# EAGLE schematic pds019_main_082_ext (EAGLE 9.6.2)

## Sheet 1 of 4
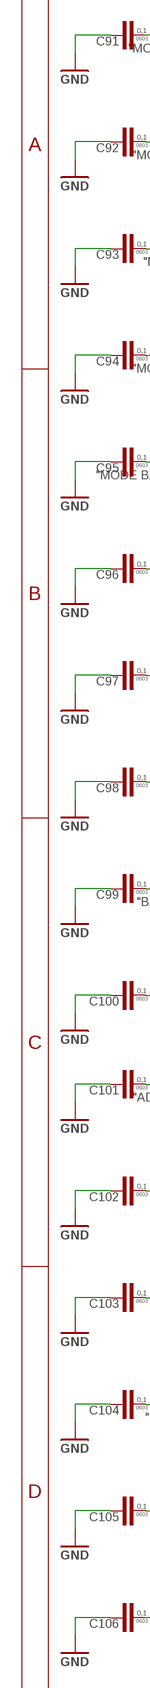
[diagram p0: schematic, sheet 1, part 1 of 2]
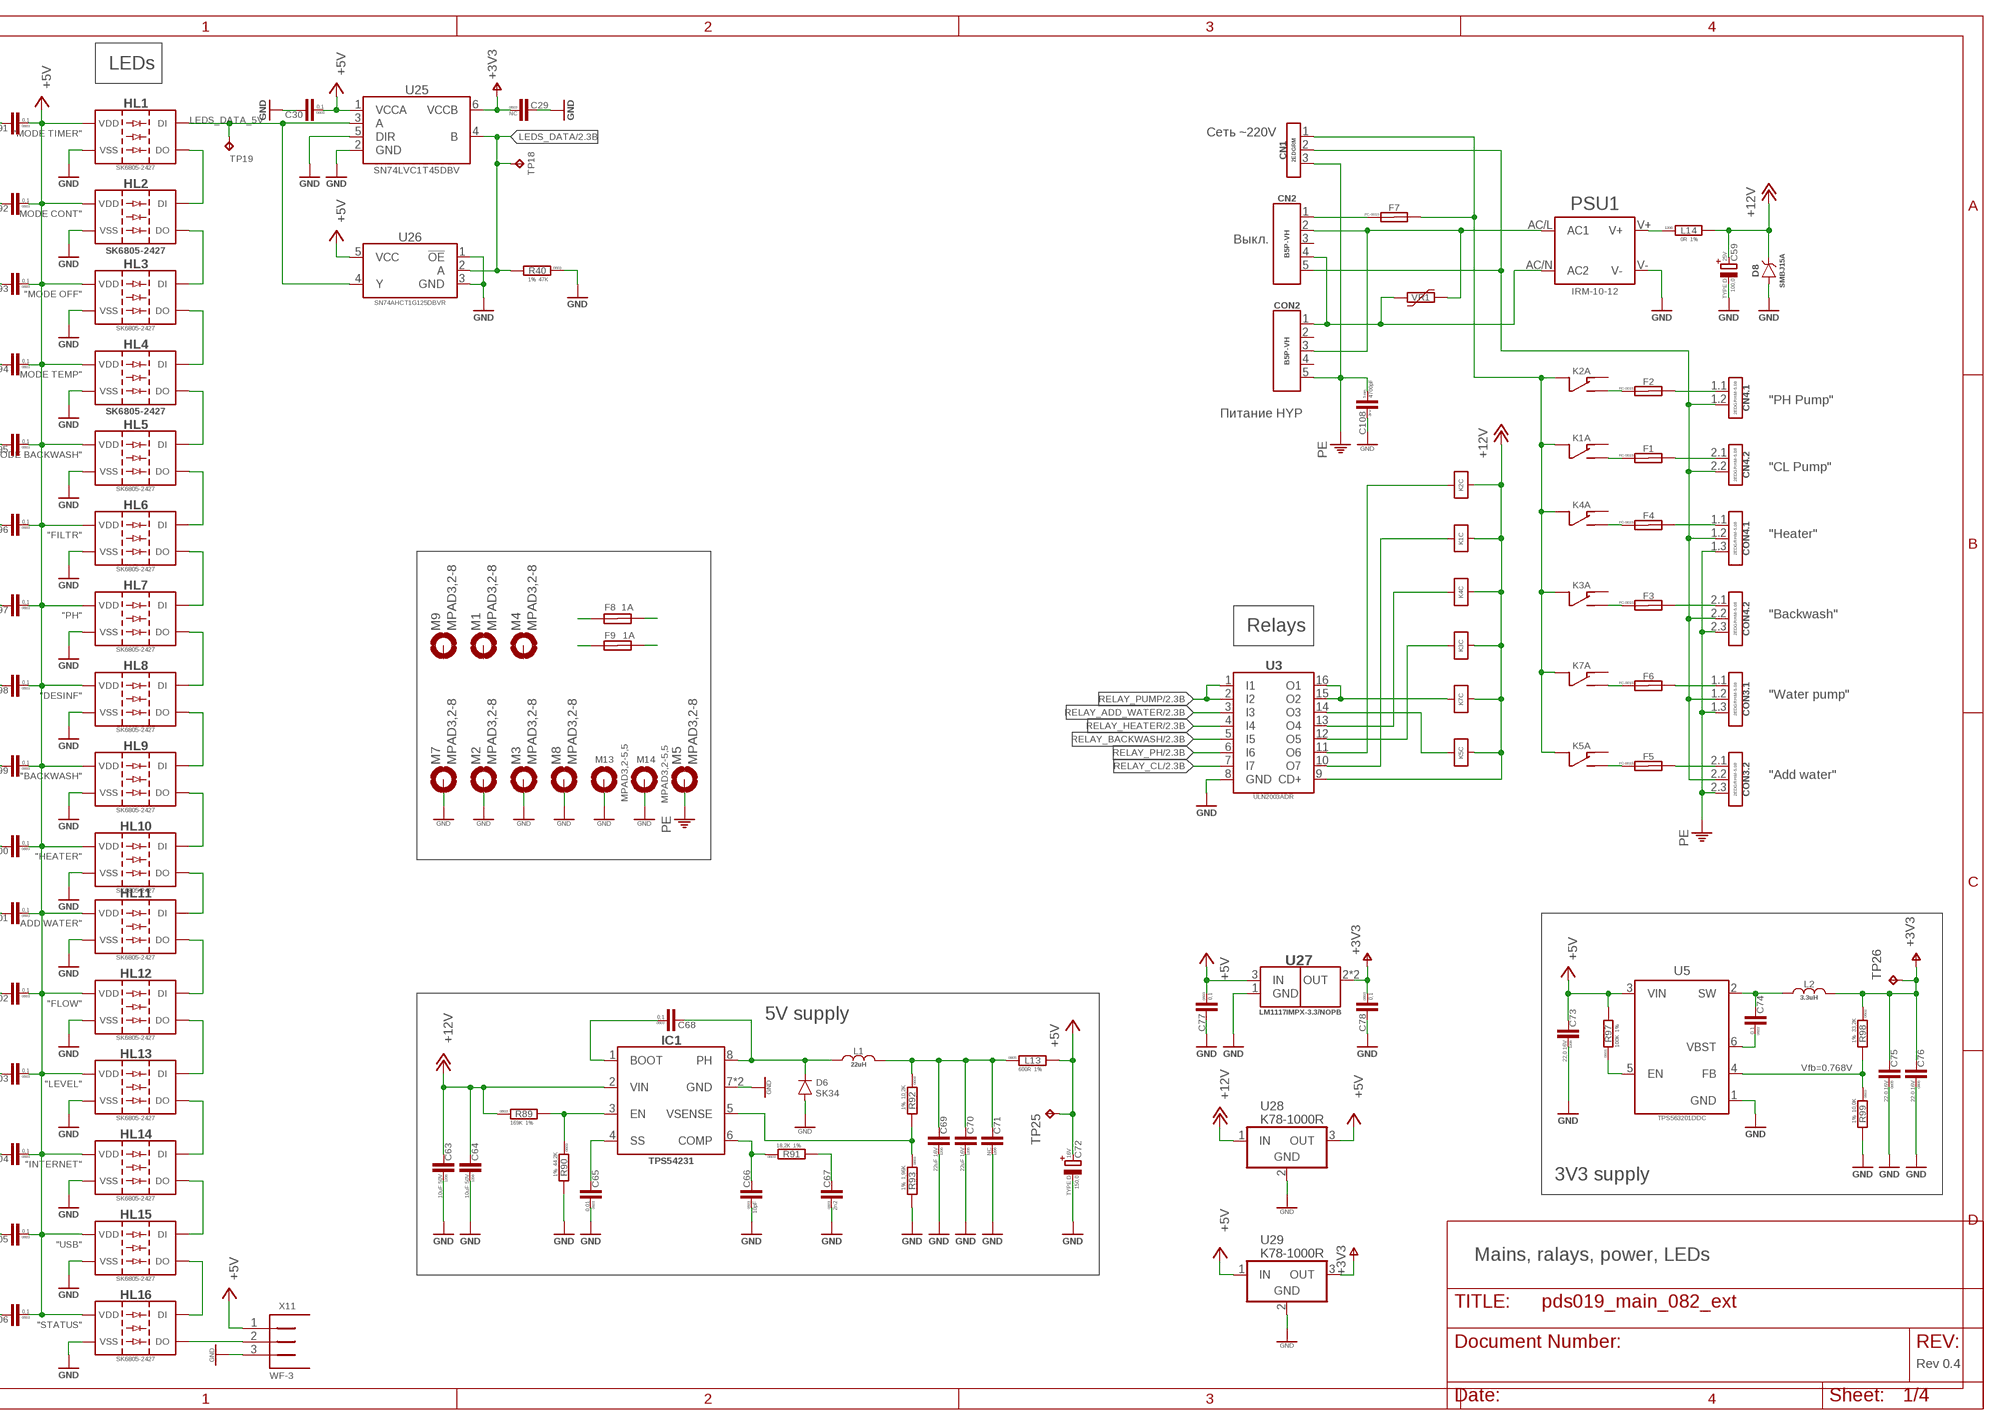
[diagram p1: schematic, sheet 1, part 2 of 2]

### Parts
C29  NC  C-0603  [C0603]
C30  0,1  C-0603  [C0603]
C59  100,0  CPOL-SMD-TYPE-D  [CTANT_7X4]
C63  10uF 50V  C-1206  [C1206]
C64  10uF 50V  C-1206  [C1206]
C65  0,01  C-0603  [C0603]
C66  10pF  C-0603  [C0603]
C67  2n2  C-0603  [C0603]
C68  0,1  C-0603  [C0603]
C69  22uF 16V  C-1206  [C1206]
C70  22uF 16V  C-1206  [C1206]
C71  NC  C-1206  [C1206]
C72  150,0  CPOL-SMD-TYPE-D  [CTANT_7X4]
C73  22,0 16V  C-1206  [C1206]
C74  0,1  C-0603  [C0603]
C75  22,0 16V  C-0805  [C0805]
C76  22,0 16V  C-0805  [C0805]
C77  0,1  C-0603  [C0603]
C78  0,1  C-0603  [C0603]
C91  0,1  C-0603  [C0603]
C92  0,1  C-0603  [C0603]
C93  0,1  C-0603  [C0603]
C94  0,1  C-0603  [C0603]
C95  0,1  C-0603  [C0603]
C96  0,1  C-0603  [C0603]
C97  0,1  C-0603  [C0603]
C98  0,1  C-0603  [C0603]
C99  0,1  C-0603  [C0603]
C100  0,1  C-0603  [C0603]
C101  0,1  C-0603  [C0603]
C102  0,1  C-0603  [C0603]
C103  0,1  C-0603  [C0603]
C104  0,1  C-0603  [C0603]
C105  0,1  C-0603  [C0603]
C106  0,1  C-0603  [C0603]
C108  4700pF  C-RADIAL-5MM  [C_5MM]
CN1  2EDGRM-7.62-03P  CON-3P-2EDGRM-7.62  [2EDGRM-7.62-03P]
CN2  CON-5P-JST-VH  [B5P-VH]
CN4  CON-2X2  [2EDGRHM-5.08-04P]
CON2  CON-5P-JST-VH  [B5P-VH]
CON3  CON-2X3  [2EDGRHM-5.08-06P]
CON4  CON-2X3  [2EDGRHM-5.08-06P]
D6  SK34  SS34  [DO-214AC(SMA)]
D8  SMBJ15A  SMBJ15A-SMB  [DO-214AA(SMB)]
F1  1A  FUSE-FC-001S  [FC-001S]
F2  1A  FUSE-FC-001S  [FC-001S]
F3  1A  FUSE-FC-001S  [FC-001S]
F4  1A  FUSE-FC-001S  [FC-001S]
F5  1A  FUSE-FC-001S  [FC-001S]
F6  1A  FUSE-FC-001S  [FC-001S]
F7  1A  FUSE-FC-001S  [FC-001S]
F8  1A  FUSE-FC-001S  [FC-001S]
F9  1A  FUSE-FC-001S  [FC-001S]
HL1  SK6805-2427  NEOPIXEL-SK6805-2427  [SK6805-2427]
HL2  SK6805-2427  NEOPIXEL-SK6805-2427  [SK6805-2427]
HL3  SK6805-2427  NEOPIXEL-SK6805-2427  [SK6805-2427]
HL4  SK6805-2427  NEOPIXEL-SK6805-2427  [SK6805-2427]
HL5  SK6805-2427  NEOPIXEL-SK6805-2427  [SK6805-2427]
HL6  SK6805-2427  NEOPIXEL-SK6805-2427  [SK6805-2427]
HL7  SK6805-2427  NEOPIXEL-SK6805-2427  [SK6805-2427]
HL8  SK6805-2427  NEOPIXEL-SK6805-2427  [SK6805-2427]
HL9  SK6805-2427  NEOPIXEL-SK6805-2427  [SK6805-2427]
HL10  SK6805-2427  NEOPIXEL-SK6805-2427  [SK6805-2427]
HL11  SK6805-2427  NEOPIXEL-SK6805-2427  [SK6805-2427]
HL12  SK6805-2427  NEOPIXEL-SK6805-2427  [SK6805-2427]
HL13  SK6805-2427  NEOPIXEL-SK6805-2427  [SK6805-2427]
HL14  SK6805-2427  NEOPIXEL-SK6805-2427  [SK6805-2427]
HL15  SK6805-2427  NEOPIXEL-SK6805-2427  [SK6805-2427]
HL16  SK6805-2427  NEOPIXEL-SK6805-2427  [SK6805-2427]
IC1  TPS54231  [SOIC8-POWERPAD]
K1  HLS8-22F-DC12V-C  SRD-U  [SRD_UNIV]
K2  HLS8-22F-DC12V-C  SRD-U  [SRD_UNIV]
K3  HLS8-22F-DC12V-C  SRD-U  [SRD_UNIV]
K4  HLS8-22F-DC12V-C  SRD-U  [SRD_UNIV]
K5  HLS8-22F-DC12V-C  SRD-U  [SRD_UNIV]
K7  SRD-SLC  [SLC-12VDC-SL-C]
L1  22uH  22µH-0630  [LSMD_06030]
L2  3.3uH  3.3µH-0520  [LSMD_05020]
L13  600R  R-1%-0805  [R0805]
L14  0R  R-1%-1206  [R1206]
M1  MPAD3,2-8  [MPAD_3,2_8]
M2  MPAD3,2-8  [MPAD_3,2_8]
M3  MPAD3,2-8  [MPAD_3,2_8]
M4  MPAD3,2-8  [MPAD_3,2_8]
M5  MPAD3,2-8  [MPAD_3,2_8]
M7  MPAD3,2-8  [MPAD_3,2_8]
M8  MPAD3,2-8  [MPAD_3,2_8]
M9  MPAD3,2-8  [MPAD_3,2_8]
M13  MPAD3,2-5,5  [MPAD_3,2_5,5]
M14  MPAD3,2-5,5  [MPAD_3,2_5,5]
PSU1  IRM-10-12  [IRM-10]
R40  47K  R-1%-0603  [R0603]
R89  169K  R-1%-0603  [R0603]
R90  44,2K  R-1%-0603  [R0603]
R91  18,2K  R-1%-0603  [R0603]
R92  10,2K  R-1%-0603  [R0603]
R93  1,96K  R-1%-0603  [R0603]
R97  100K  R-1%-0603  [R0603]
R98  33,2K  R-1%-0603  [R0603]
R99  10,0K  R-1%-0603  [R0603]
TP18  TPTP16R  [TP16R]
TP19  TPTP16R  [TP16R]
TP25  TPTP16R  [TP16R]
TP26  TPTP16R  [TP16R]
U3  ULN2003AD  [SO16]
U5  TPS563201DDC  TPS563200  [SOT23-6]
U25  NC  SN74LVC1T45DBV  [SOT23-6]
U26  SN74AHCT1G125DBVR-SOT23-5  [SOT23-5]
U27  3.3V  LM1117-3.3-SOT223  [SOT-223]
U28  K78-1000R  [K78XX-1000R3_V]
U29  K78-1000R  [K78XX-1000R3_V]
VR1  S20K275  VARISTOR-22MM  [S20K420]
X11  WF-3  CONN_3PIN-KF2510-03  [KF2510-03]

### Nets
3V3_EN: R97.1 U5.5(EN)
+3V3: C29.1 C75.2 C76.2 C78.1 L2.2 R98.1 TP26.TP U25.6(VCCB) U27.2(OUT) U27.4(OUT) U29.3(OUT) ; also sheet 2,3
+5V: C30.1 C72.+ C73.P$2 C77.1 C91.1 C92.1 C93.1 C94.1 C95.1 C96.1 C97.1 C98.1 C99.1 C100.1 C101.1 C102.1 C103.1 C104.1 C105.1 C106.1 HL1.4(VDD) HL2.4(VDD) HL3.4(VDD) HL4.4(VDD) HL5.4(VDD) HL6.4(VDD) HL7.4(VDD) HL8.4(VDD) HL9.4(VDD) HL10.4(VDD) HL11.4(VDD) HL12.4(VDD) HL13.4(VDD) HL14.4(VDD) HL15.4(VDD) HL16.4(VDD) L13.2 R97.2 TP25.TP U5.3(VIN) U25.1(VCCA) U26.5(VCC) U27.3(IN) U28.3(OUT) U29.1(IN) X11.1 ; also sheet 2,3
+12V: C59.+ C63.P$2 C64.P$2 D8.C IC1.2(VIN) K1.2 K2.2 K3.2 K4.2 K5.2 K7.C2 L14.P$2 R89.1 U3.9(CD+) U28.1(IN) ; also sheet 3
AC_L: CN1.1 F7.2-1 F7.2-2 K1.1(A:COM) K2.1(A:COM) K3.1(A:COM) K4.1(A:COM) K5.1(A:COM) K7.COM(A:COM)
AC_N: CN1.2 CN2.5 CN4.1.2 CN4.2.2 CON3.1.2 CON3.2.2 CON4.1.2 CON4.2.2
F8-1: F8.1-1 F8.1-2
F8-2: F8.2-1 F8.2-2
F9-1: F9.1-1 F9.1-2
F9-2: F9.2-1 F9.2-2
GND: C29.2 C30.2 C59.- C63.P$1 C64.P$1 C65.1 C66.1 C67.1 C69.P$1 C70.P$1 C71.P$1 C72.- C73.P$1 C75.1 C76.1 C77.2 C78.2 C91.2 C92.2 C93.2 C94.2 C95.2 C96.2 C97.2 C98.2 C99.2 C100.2 C101.2 C102.2 C103.2 C104.2 C105.2 C106.2 C108.2 D6.A D8.A HL1.2(VSS) HL2.2(VSS) HL3.2(VSS) HL4.2(VSS) HL5.2(VSS) HL6.2(VSS) HL7.2(VSS) HL8.2(VSS) HL9.2(VSS) HL10.2(VSS) HL11.2(VSS) HL12.2(VSS) HL13.2(VSS) HL14.2(VSS) HL15.2(VSS) HL16.2(VSS) IC1.7(GND) IC1.POWERPAD(GND) M2.1(MOUNT) M3.1(MOUNT) M7.1(MOUNT) M8.1(MOUNT) M13.1(MOUNT) M14.1(MOUNT) PSU1.V- R40.1 R90.2 R93.2 R99.2 U3.8(GND) U5.1(GND) U25.2(GND) U25.5(DIR) U26.1(!OE) U26.3(GND) U27.1(GND) U28.2(GND) U29.2(GND) X11.3 ; also sheet 2,3
LED1_LED2: HL1.1(DO) HL2.3(DI)
LED2_LED3: HL2.1(DO) HL3.3(DI)
LED3_LED4: HL3.1(DO) HL4.3(DI)
LED4_LED5: HL4.1(DO) HL5.3(DI)
LED6_LED7: HL5.1(DO) HL6.3(DI)
LED7_LED8: HL7.1(DO) HL8.3(DI)
LED8_LED9: HL8.1(DO) HL9.3(DI)
LED9_LED10: HL9.1(DO) HL10.3(DI)
LED10_LED11: HL10.1(DO) HL11.3(DI)
LED11_LED12: HL11.1(DO) HL12.3(DI)
LED12_LED13: HL12.1(DO) HL13.3(DI)
LED13_LED14: HL13.1(DO) HL14.3(DI)
LED14_LED15: HL14.1(DO) HL15.3(DI)
LED15_LED16: HL15.1(DO) HL16.3(DI)
LEDS_DATA: R40.2 TP18.TP U25.4(B) U26.2(A) ; also sheet 2
LEDS_DATA_5V: HL1.3(DI) TP19.TP U25.3(A) U26.4(Y) ; also sheet 2
N$6: CN2.1 F7.1-1 F7.1-2
N$7: CN2.2 CON2.3 PSU1.AC/L(AC1) VR1.2
N$8: CN2.4 CON2.1 PSU1.AC/N(AC2) VR1.1
N$16: L14.P$1 PSU1.V+
N$17: C69.P$2 C70.P$2 C71.P$2 L1.2 L13.1 R92.1
N$39: K7.C1 U3.15(O2) U3.16(O1)
N$45: HL6.1(DO) HL7.3(DI)
N$54: HL16.1(DO) X11.2
N$60: F2.1-1 F2.1-2 K2.3(A:NO)
N$69: C65.2 IC1.4(SS)
N$112: K2.5 U3.11(O6)
N$116: K1.5 U3.10(O7)
N$149: C68.1 IC1.1(BOOT)
N$164: K4.5 U3.13(O4)
N$170: K3.5 U3.12(O5)
N$175: K5.5 U3.14(O3)
N$183: F6.1-1 F6.1-2 K7.NO(A:NO)
N$190: C68.2 D6.C IC1.8(PH) L1.1
N$192: C66.2 IC1.6(COMP) R91.1
N$198: C67.2 R91.2
N$201: CN4.1.1 F2.2-1 F2.2-2
N$202: CN4.2.1 F1.2-1 F1.2-2
N$203: F1.1-1 F1.1-2 K1.3(A:NO)
N$204: CON4.1.1 F4.2-1 F4.2-2
N$205: IC1.5(VSENSE) R92.2 R93.1
N$207: IC1.3(EN) R89.2 R90.1
N$208: F4.1-1 F4.1-2 K4.3(A:NO)
N$211: CON4.2.1 F3.2-1 F3.2-2
N$212: F3.1-1 F3.1-2 K3.3(A:NO)
N$214: CON3.1.1 F6.2-1 F6.2-2
N$215: F5.1-1 F5.1-2 K5.3(A:NO)
N$217: CON3.2.1 F5.2-1 F5.2-2
PE: C108.1 CN1.3 CON2.5 CON3.1.3 CON3.2.3 CON4.1.3 CON4.2.3 M5.1(MOUNT) ; also sheet 3
RELAY_ADD_WATER: U3.3(I3) ; also sheet 2
RELAY_BACKWASH: U3.5(I5) ; also sheet 2
RELAY_CL: U3.7(I7) ; also sheet 2
RELAY_HEATER: U3.4(I4) ; also sheet 2
RELAY_PH: U3.6(I6) ; also sheet 2
RELAY_PUMP: U3.1(I1) U3.2(I2) ; also sheet 2
TPS56_FB: R98.2 R99.1 U5.4(FB)
TPS56_SW: C74.2 L2.1 U5.2(SW)
TPS56_VBST: C74.1 U5.6(VBST)
Unconnected: CN2.3 CON2.2 CON2.4 K1.4(A:NC) K2.4(A:NC) K3.4(A:NC) K4.4(A:NC) K5.4(A:NC) K7.NC(A:NC) M1.1(MOUNT) M4.1(MOUNT) M9.1(MOUNT)

### Notes on the sheet
- LEDs
- "MODE TIMER" | Сеть ~220V
- "MODE CONT"
- Выкл.
- "MODE OFF"
- "MODE TEMP"
- "PH Pump"
- Питание HYP
- "MODE BACKWASH"
- "CL Pump"
- "FILTR" | "Heater"
- "PH" | "Backwash"
- Relays
- "DESINF" | "Water pump"
- "BACKWASH" | "Add water"
- "HEATER"
- "ADD WATER"
- "FLOW"
- 5V supply
- Vfb=0.768V
- "LEVEL"
- "INTERNET"
- 3V3 supply
- "USB"
- Mains, ralays, power, LEDs
- "STATUS"
- Rev 0.4

## Sheet 2 of 4
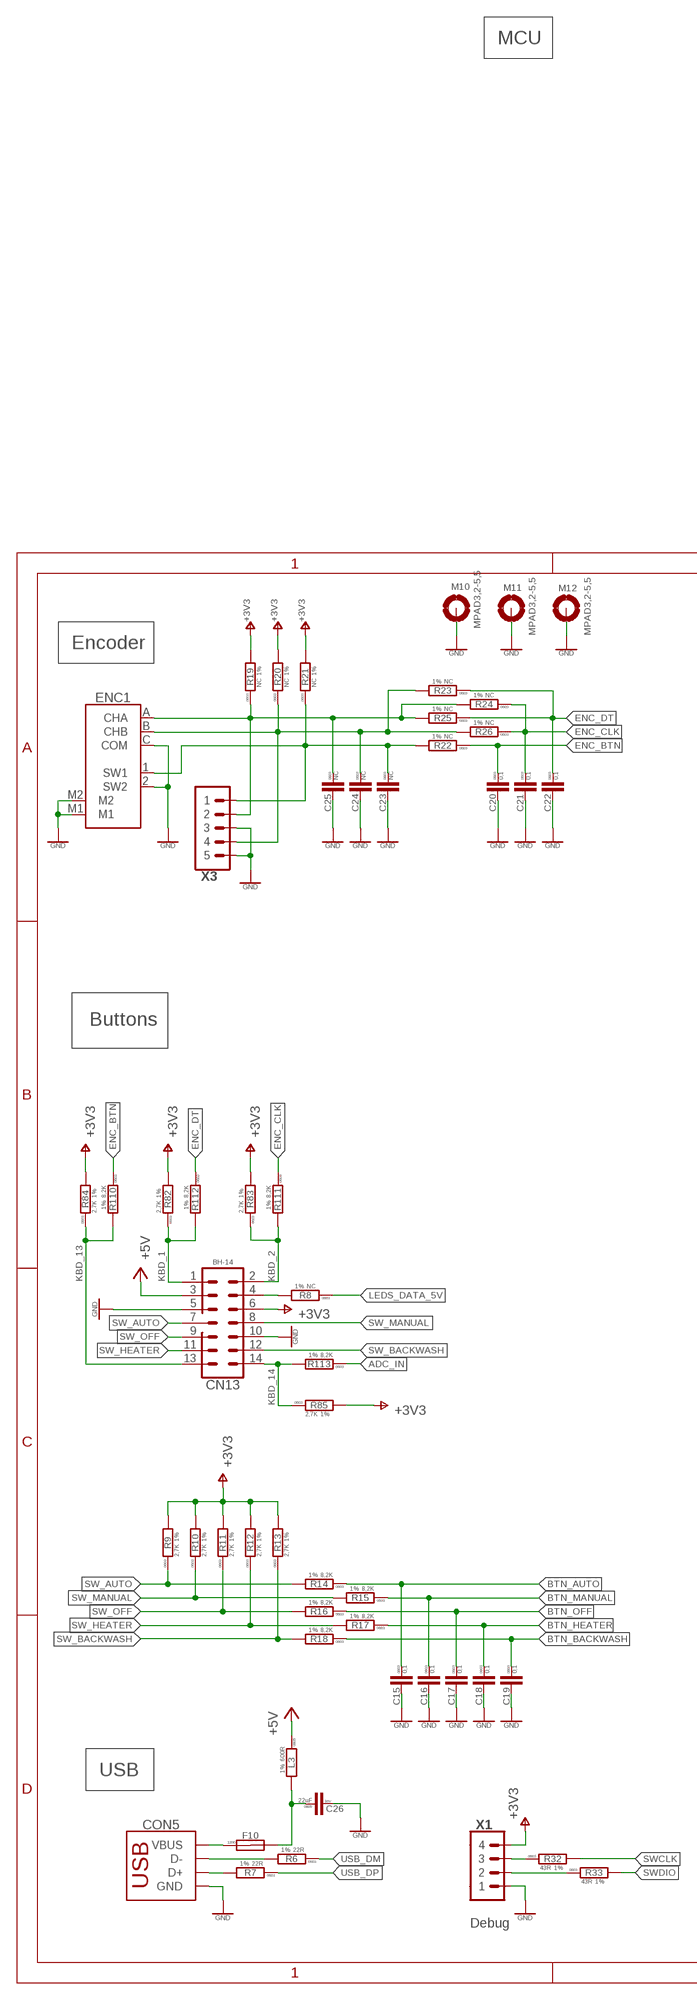
[diagram p2: schematic, sheet 2, part 1 of 2]
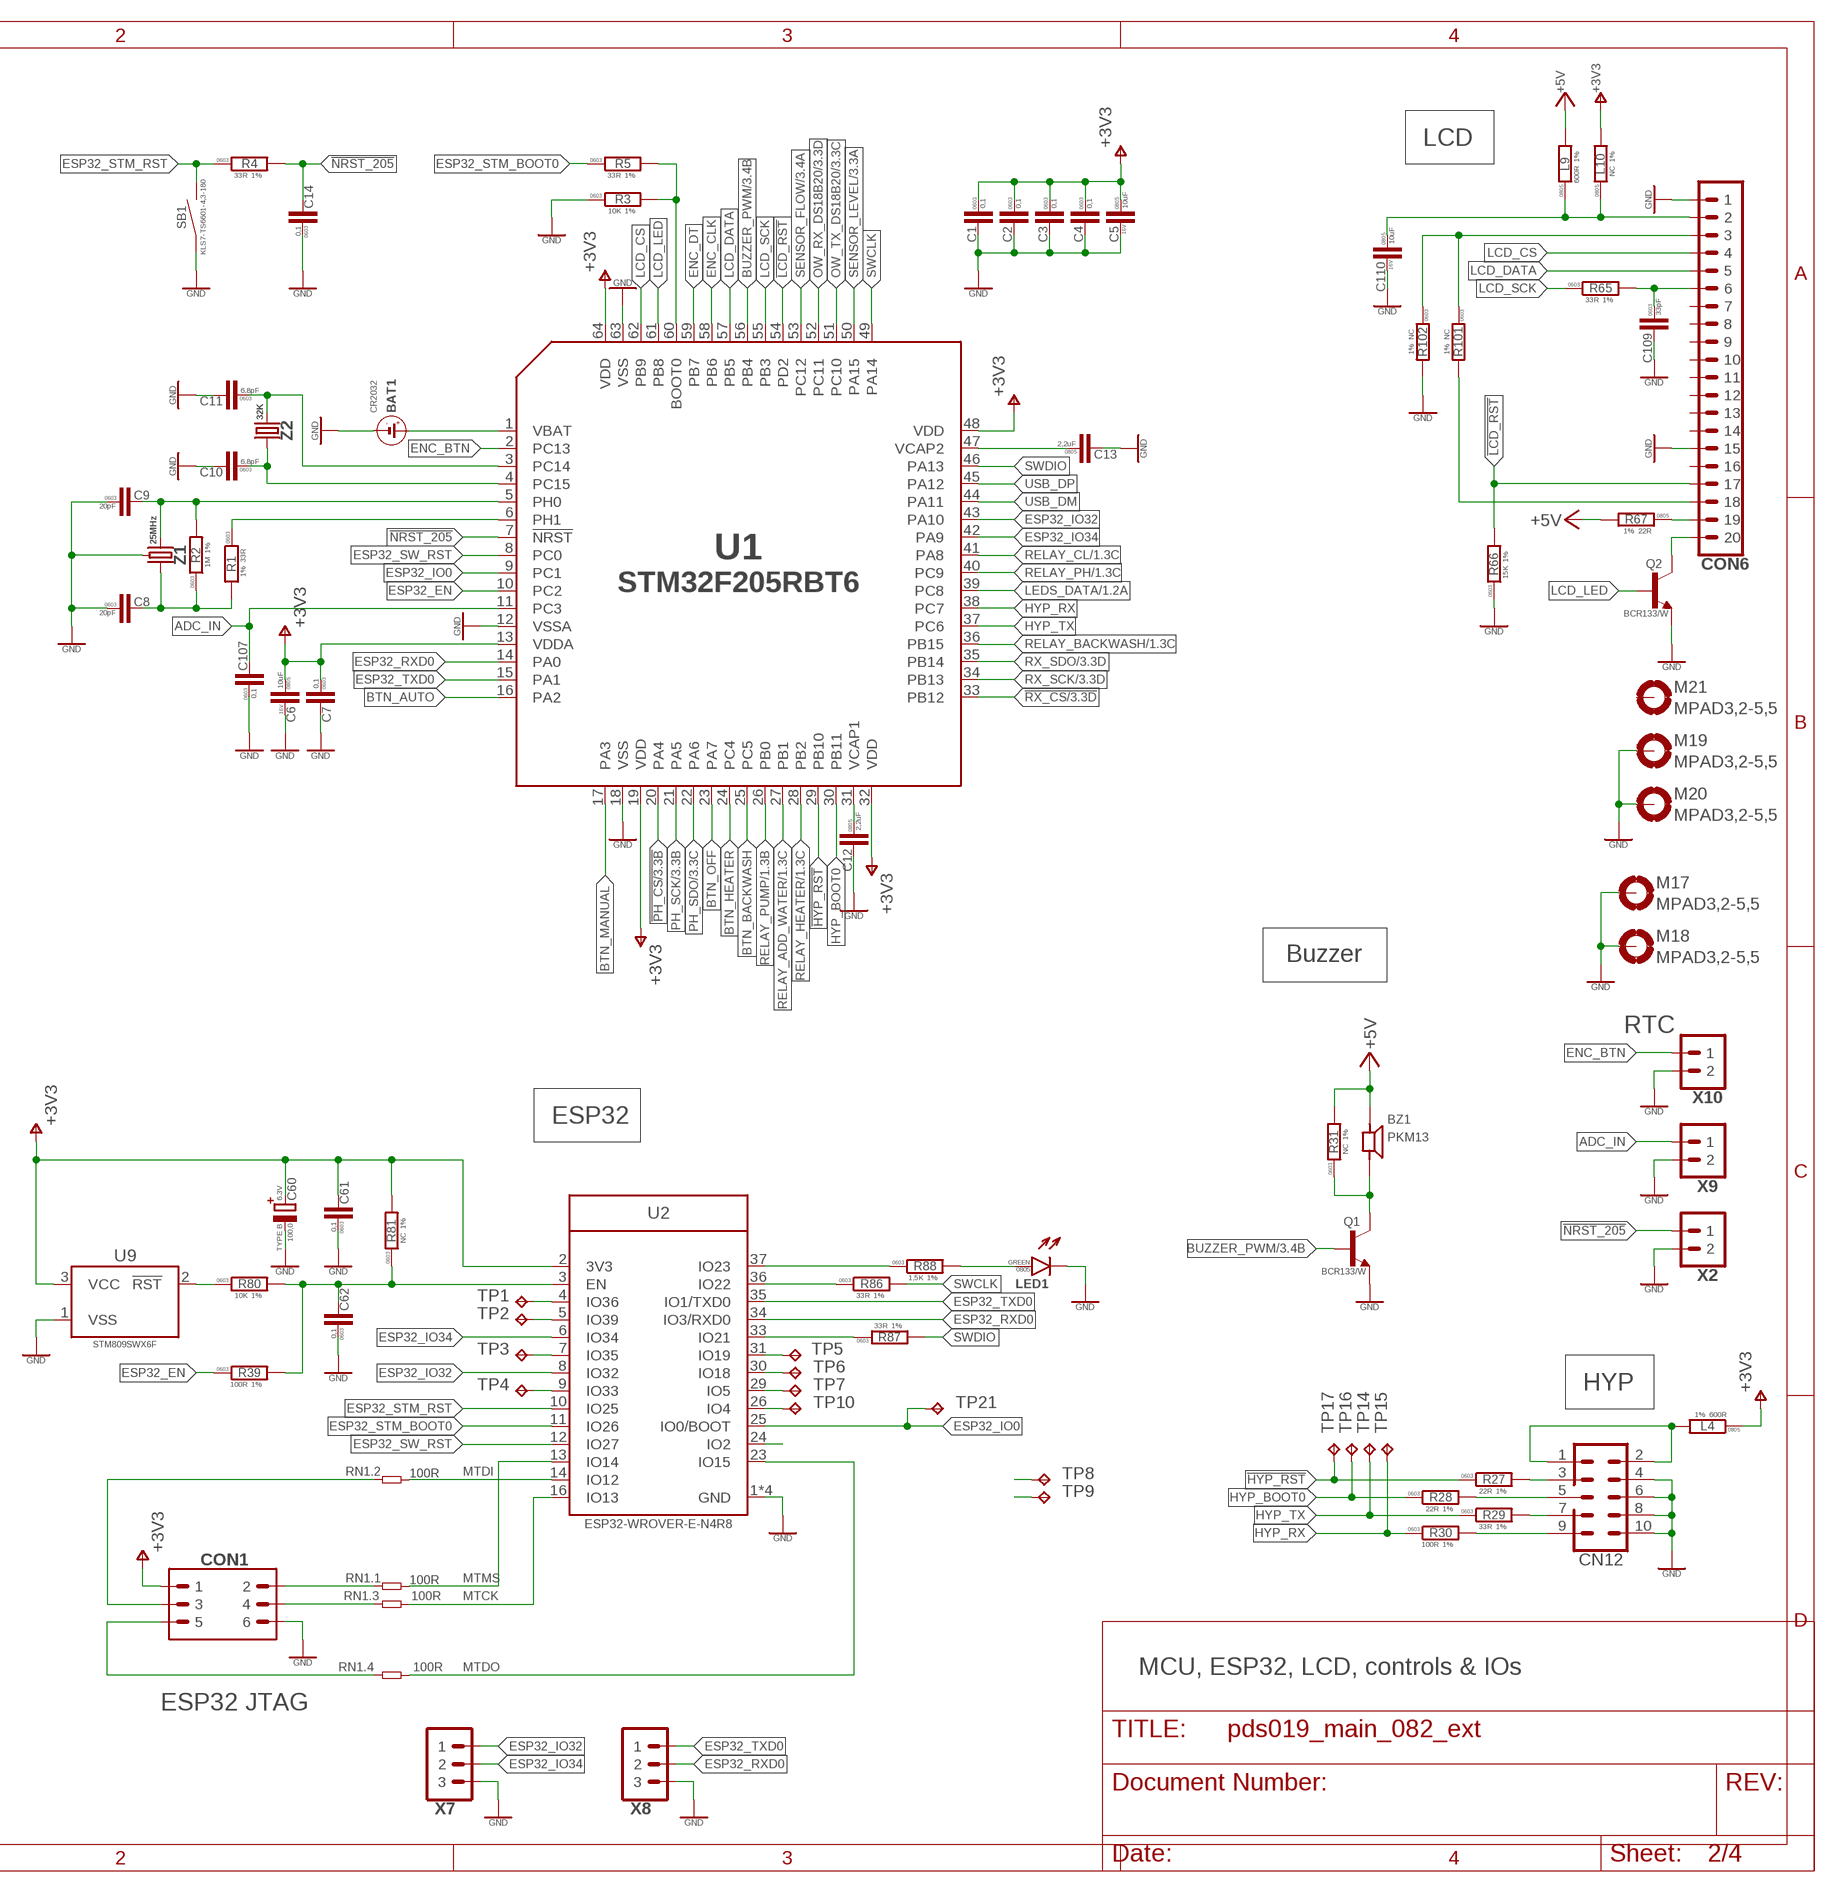
[diagram p3: schematic, sheet 2, part 2 of 2]

### Parts
BAT1  BATTERY-L-KLS5-CR2032-01  [CR2032H]
BZ1  PKM13  BUZZER-PKM13  [PKM13]
C1  0,1  C-0603  [C0603]
C2  0,1  C-0603  [C0603]
C3  0,1  C-0603  [C0603]
C4  0,1  C-0603  [C0603]
C5  10uF  C-0805  [C0805]
C6  10uF  C-0805  [C0805]
C7  0,1  C-0603  [C0603]
C8  20pF  C-0603  [C0603]
C9  20pF  C-0603  [C0603]
C10  6,8pF  C-0603  [C0603]
C11  6,8pF  C-0603  [C0603]
C12  2,2uF  C-0805  [C0805]
C13  2,2uF  C-0805  [C0805]
C14  0,1  C-0603  [C0603]
C15  0,1  C-0603  [C0603]
C16  0,1  C-0603  [C0603]
C17  0,1  C-0603  [C0603]
C18  0,1  C-0603  [C0603]
C19  0,1  C-0603  [C0603]
C20  0,1  C-0603  [C0603]
C21  0,1  C-0603  [C0603]
C22  0,1  C-0603  [C0603]
C23  NC  C-0603  [C0603]
C24  NC  C-0603  [C0603]
C25  NC  C-0603  [C0603]
C26  22uF  C-0805  [C0805]
C60  100,0  CPOL-TANT-TYPE-B  [CTANT_B]
C61  0,1  C-0603  [C0603]
C62  0,1  C-0603  [C0603]
C107  0,1  C-0603  [C0603]
C109  33pF  C-0603  [C0603]
C110  10uF  C-0805  [C0805]
CN12  BH-10  IDC_CONN10-BH10  [IDC_2X05]
CN13  BH14  IDC_CONN14-BH14  [IDC_2X07]
CON1  PINHEAD_2X03-PTH-2.54  [2X03-PTH-2.54]
CON5  USB-A-KLS1-191  [KLS1-191-4P-0.7]
CON6  PINHEAD_1X20-2.54-MALE-LONG  [1X20-PTH-2.54-LONG]
ENC1  PEC12R-4XXXF-S  ENC-PEC12R-4XXXF-SXXXX  [PEC12R-4XXXF-SXXXX]
F10  FUSE-1206  [F1206]
L3  600R  R-1%-0805  [R0805]
L4  600R  R-1%-0805  [R0805]
L9  600R  R-1%-0805  [R0805]
L10  NC  R-1%-0805  [R0805]
LED1  LED-0805  [LED0805]
M10  MPAD3,2-5,5  [MPAD_3,2_5,5]
M11  MPAD3,2-5,5  [MPAD_3,2_5,5]
M12  MPAD3,2-5,5  [MPAD_3,2_5,5]
M17  MPAD3,2-5,5  [MPAD_3,2_5,5]
M18  MPAD3,2-5,5  [MPAD_3,2_5,5]
M19  MPAD3,2-5,5  [MPAD_3,2_5,5]
M20  MPAD3,2-5,5  [MPAD_3,2_5,5]
M21  MPAD3,2-5,5  [MPAD_3,2_5,5]
Q1  NC  BCR133  [SOT23B-3]
Q2  BCR133  [SOT23B-3]
R1  33R  R-1%-0603  [R0603]
R2  1M  R-1%-0603  [R0603]
R3  10K  R-1%-0603  [R0603]
R4  33R  R-1%-0603  [R0603]
R5  33R  R-1%-0603  [R0603]
R6  22R  R-1%-0603  [R0603]
R7  22R  R-1%-0603  [R0603]
R8  NC  R-1%-0603  [R0603]
R9  2,7K  R-1%-0603  [R0603]
R10  2,7K  R-1%-0603  [R0603]
R11  2,7K  R-1%-0603  [R0603]
R12  2,7K  R-1%-0603  [R0603]
R13  2,7K  R-1%-0603  [R0603]
R14  8,2K  R-1%-0603  [R0603]
R15  8,2K  R-1%-0603  [R0603]
R16  8,2K  R-1%-0603  [R0603]
R17  8,2K  R-1%-0603  [R0603]
R18  8,2K  R-1%-0603  [R0603]
R19  NC  R-1%-0603  [R0603]
R20  NC  R-1%-0603  [R0603]
R21  NC  R-1%-0603  [R0603]
R22  NC  R-1%-0603  [R0603]
R23  NC  R-1%-0603  [R0603]
R24  NC  R-1%-0603  [R0603]
R25  NC  R-1%-0603  [R0603]
R26  NC  R-1%-0603  [R0603]
R27  22R  R-1%-0603  [R0603]
R28  22R  R-1%-0603  [R0603]
R29  33R  R-1%-0603  [R0603]
R30  100R  R-1%-0603  [R0603]
R31  NC  R-1%-0603  [R0603]
R32  43R  R-1%-0603  [R0603]
R33  43R  R-1%-0603  [R0603]
R39  100R  R-1%-0603  [R0603]
R65  33R  R-1%-0603  [R0603]
R66  15K  R-1%-0603  [R0603]
R67  22R  R-1%-0805  [R0805]
R80  10K  R-1%-0603  [R0603]
R81  NC  R-1%-0603  [R0603]
R82  2,7K  R-1%-0603  [R0603]
R83  2,7K  R-1%-0603  [R0603]
R84  2,7K  R-1%-0603  [R0603]
R85  2,7K  R-1%-0603  [R0603]
R86  33R  R-1%-0603  [R0603]
R87  33R  R-1%-0603  [R0603]
R88  1,5K  R-1%-0603  [R0603]
R101  NC  R-1%-0603  [R0603]
R102  NC  R-1%-0603  [R0603]
R110  8,2K  R-1%-0603  [R0603]
R111  8,2K  R-1%-0603  [R0603]
R112  8,2K  R-1%-0603  [R0603]
R113  8,2K  R-1%-0603  [R0603]
RN1  100R  RN4X1_EXP-YC164  [RN_YC164]
SB1  KLS7-TS6601-4,3-180  TACT_SWITCH-6X6-PTH  [SW4-6.0X6.0X5.0MM]
TP1  TPTP18R  [TP18R]
TP2  TPTP18R  [TP18R]
TP3  TPTP18R  [TP18R]
TP4  TPTP18R  [TP18R]
TP5  TPTP16R  [TP16R]
TP6  TPTP16R  [TP16R]
TP7  TPTP16R  [TP16R]
TP8  TPTP16R  [TP16R]
TP9  TPTP16R  [TP16R]
TP10  TPTP16R  [TP16R]
TP14  TPTP16R  [TP16R]
TP15  TPTP16R  [TP16R]
TP16  TPTP16R  [TP16R]
TP17  TPTP16R  [TP16R]
TP21  TPTP16R  [TP16R]
U1  STM32F2xxR  STM32F205RBT6  [TQFP64]
U2  ESP32-WROVER-(I)E  [ESP32-WROVER-E]
U9  MAX809S  [SOT23B-3]
X1  PINHEAD_1X04-2.54  [1X04-PTH-2.54]
X2  PINHEAD_1X02-2.54  [1X02-PTH-2.54]
X3  PINHEAD_1X05-2.54  [1X05-PTH-2.54]
X7  PINHEAD_1X03-2.54  [1X03-PTH-2.54]
X8  PINHEAD_1X03-2.54  [1X03-PTH-2.54]
X9  PINHEAD_1X02-2.54  [1X02-PTH-2.54]
X10  PINHEAD_1X02-2.54  [1X02-PTH-2.54]
Z1  25MHz  CRYSTAL-4P-24MHZ-3.2X2.5  [OSCILLATOR-3.2X2.5-4P]
Z2  32K  CRYSTAL-2P-32X15  [32X15]

### Nets
!HYP_RST: R27.1 TP17.TP U1.29(PB10)
!LCD_RST: CON6.17 R66.2 U1.54(PD2)
!NRST_205: C14.2 R4.2 U1.7(!NRST) X2.1
!PH_CS: U1.20(PA4) ; also sheet 3
!RX_CS: U1.33(PB12) ; also sheet 3
+3V3: C1.1 C2.1 C3.1 C4.1 C5.1 C6.1 C7.1 C60.+ C61.2 CN13.6 CON1.1 L4.1 L10.2 R9.2 R10.2 R11.2 R12.2 R13.2 R19.2 R20.2 R21.2 R81.2 R82.2 R83.2 R84.2 R85.2 U1.13(VDDA) U1.19(VDD) U1.32(VDD) U1.48(VDD) U1.64(VDD) U2.2(3V3) U9.3(VCC) X1.4 ; also sheet 1,3
+5V: BZ1.B+ CN13.3 L3.1 L9.2 R31.2 R67.2 ; also sheet 1,3
ADC_IN: C107.2 R113.1 U1.11(PC3) X9.1
BOOT0_205: R3.2 R5.2 U1.60(BOOT0)
BTN_AUTO: C15.1 R14.1 U1.16(PA2)
BTN_BACKWASH: C19.1 R18.1 U1.25(PC5)
BTN_HEATER: C18.1 R17.1 U1.24(PC4)
BTN_MANUAL: C16.1 R15.1 U1.17(PA3)
BTN_OFF: C17.1 R16.1 U1.23(PA7)
BUZZER_PWM: Q1.1(B) U1.56(PB4) ; also sheet 3
ENC_A: C25.1 ENC1.A(CHA) R19.1 R24.2 R25.2 X3.2
ENC_B: C24.1 ENC1.B(CHB) R20.1 R23.2 R26.2 X3.4
ENC_BTN: C20.1 R22.1 R110.1 U1.2(PC13) X10.1
ENC_CLK: C21.1 R24.1 R26.1 R111.1 U1.58(PB6)
ENC_DT: C22.1 R23.1 R25.1 R112.1 U1.59(PB7)
ENC_SW: C23.1 ENC1.1(SW1) R21.1 R22.2 X3.1
ESP32_EN: R39.1 U1.10(PC2)
ESP32_IO0: TP21.TP U1.9(PC1) U2.25(IO0/BOOT)
ESP32_IO32: U1.43(PA10) U2.8(IO32) X7.1
ESP32_IO34: U1.42(PA9) U2.6(IO34) X7.2
ESP32_RXD0: U1.14(PA0) U2.34(IO3/RXD0) X8.2
ESP32_STM_BOOT0: R5.1 U2.11(IO26)
ESP32_STM_RST: R4.1 SB1.2 SB1.3 U2.10(IO25)
ESP32_STM_SWCLK: R86.1 U2.36(IO22)
ESP32_STM_SWDIO: R87.1 U2.33(IO21)
ESP32_SW_RST: U1.8(PC0) U2.12(IO27)
ESP32_TXD0: U1.15(PA1) U2.35(IO1/TXD0) X8.1
GND: BAT1.-(NEGATIVE) C1.2 C2.2 C3.2 C4.2 C5.2 C6.2 C7.2 C8.1 C9.1 C10.2 C11.2 C12.2 C13.2 C14.1 C15.2 C16.2 C17.2 C18.2 C19.2 C20.2 C21.2 C22.2 C23.2 C24.2 C25.2 C26.2 C60.- C61.1 C62.1 C107.1 C109.2 C110.2 CN12.4 CN12.6 CN12.8 CN12.10 CN13.5 CN13.10 CON1.6 CON5.4(GND) CON5.SH1(GND) CON5.SH2(GND) CON5.SH3(GND) CON5.SH4(GND) CON6.1 CON6.15 ENC1.2(SW2) ENC1.C(COM) ENC1.M1 ENC1.M2 LED1.C M10.1(MOUNT) M11.1(MOUNT) M12.1(MOUNT) M17.1(MOUNT) M18.1(MOUNT) M19.1(MOUNT) M20.1(MOUNT) Q1.2(E) Q2.2(E) R3.1 R66.1 R102.2 SB1.1 SB1.4 U1.12(VSSA) U1.18(VSS) U1.63(VSS) U2.1(GND) U2.15(GND) U2.38(GND) U2.39(GND) U9.1(VSS) X1.1 X2.2 X3.3 X3.5 X7.3 X8.3 X9.2 X10.2 Z1.2(GND) Z1.4(GND) ; also sheet 1,3
HYP_BOOT0: R28.1 TP16.TP U1.30(PB11)
HYP_RX: R30.1 TP15.TP U1.38(PC7)
HYP_TX: R29.1 TP14.TP U1.37(PC6)
KBD_1: CN13.1 R82.1 R112.2
KBD_2: CN13.2 R83.1 R111.2
KBD_13: CN13.13 R84.1 R110.2
KBD_14: CN13.14 R85.1 R113.2
LCD_CS: CON6.4 U1.62(PB9)
LCD_DATA: CON6.5 U1.57(PB5)
LCD_LED: Q2.1(B) U1.61(PB8)
LCD_LED_A: CON6.19 R67.1
LCD_LED_K: CON6.20 Q2.3(C)
LCD_SCK: R65.1 U1.55(PB3)
LCD_V0: CON6.3 R101.1 R102.1
LCD_VEE: CON6.18 R101.2
LEDS_DATA: U1.39(PC8) ; also sheet 1
LEDS_DATA_5V: R8.1 ; also sheet 1
MTCK: RN1.6 U2.16(IO13)
MTDI: RN1.7 U2.14(IO12)
MTDO: RN1.5 U2.23(IO15)
MTMS: RN1.8 U2.13(IO14)
N$1: CN12.1 CN12.2 L4.2
N$2: CN12.3 R27.2
N$3: CN12.5 R28.2
N$4: CN12.7 R29.2
N$5: CN12.9 R30.2
N$9: R88.1 U2.37(IO23)
N$10: LED1.A R88.2
N$18: C109.1 CON6.6 R65.2
N$19: R32.1 X1.3
N$20: R33.1 X1.2
N$22: R80.1 U9.2(!RST)
N$26: CN13.4 R8.2
N$30: C110.1 CON6.2 L9.1 L10.1
N$32: C62.2 R39.2 R80.2 R81.1 U2.3(EN)
N$35: TP1.TP U2.4(IO36)
N$36: TP2.TP U2.5(IO39)
N$43: TP3.TP U2.7(IO35)
N$44: TP4.TP U2.9(IO33)
N$46: TP5.TP U2.31(IO19)
N$47: TP6.TP U2.30(IO18)
N$48: TP7.TP U2.29(IO5)
N$49: TP8.TP
N$50: TP9.TP
N$51: TP10.TP U2.26(IO4)
N$52: U2.24(IO2)
N$58: C12.1 U1.31(VCAP1)
N$59: C13.1 U1.47(VCAP2)
N$63: C8.2 R1.2 R2.1 Z1.1
N$64: CON5.1(VBUS) F10.P$1
N$96: C26.1 F10.P$2 L3.2
N$124: CON1.5 RN1.4
N$125: CON5.2(D-) R6.2
N$131: CON5.3(D+) R7.2
N$150: CON1.2 RN1.1
N$197: BZ1.B- Q1.3(C) R31.1
N$213: CON1.3 RN1.2
N$216: CON1.4 RN1.3
OSC_IN: C9.2 R2.2 U1.5(PH0) Z1.3
OSC_OUT: R1.1 U1.6(PH1)
OW_RX_DS18B20: U1.52(PC11) ; also sheet 3
OW_TX_DS18B20: U1.51(PC10) ; also sheet 3
PH_SCK: U1.21(PA5) ; also sheet 3
PH_SDO: U1.22(PA6) ; also sheet 3
RELAY_ADD_WATER: U1.27(PB1) ; also sheet 1
RELAY_BACKWASH: U1.36(PB15) ; also sheet 1
RELAY_CL: U1.41(PA8) ; also sheet 1
RELAY_HEATER: U1.28(PB2) ; also sheet 1
RELAY_PH: U1.40(PC9) ; also sheet 1
RELAY_PUMP: U1.26(PB0) ; also sheet 1
RTC_VBAT: BAT1.+(POSITIVE) U1.1(VBAT)
RTC_XTAL_IN: C11.1 U1.3(PC14) Z2.P$2
RTC_XTAL_OUT: C10.1 U1.4(PC15) Z2.P$1
RX_SCK: U1.34(PB13) ; also sheet 3
RX_SDO: U1.35(PB14) ; also sheet 3
SENSOR_FLOW: U1.53(PC12) ; also sheet 3
SENSOR_LEVEL: U1.50(PA15) ; also sheet 3
SW_AUTO: CN13.7 R9.1 R14.2
SW_BACKWASH: CN13.12 R13.1 R18.2
SW_HEATER: CN13.11 R12.1 R17.2
SW_MANUAL: CN13.8 R10.1 R15.2
SW_OFF: CN13.9 R11.1 R16.2
SWCLK: R32.2 R86.2 U1.49(PA14)
SWDIO: R33.2 R87.2 U1.46(PA13)
USB_DM: R6.1 U1.44(PA11)
USB_DP: R7.1 U1.45(PA12)
Unconnected: CON6.7 CON6.8 CON6.9 CON6.10 CON6.11 CON6.12 CON6.13 CON6.14 CON6.16 M21.1(MOUNT)

### Notes on the sheet
- MCU
- Encoder | LCD
- Buttons
- Buzzer
- RTC
- ESP32
- HYP
- USB
- MCU, ESP32, LCD, controls & IOs
- ESP32 JTAG
- Debug

## Sheet 3 of 4
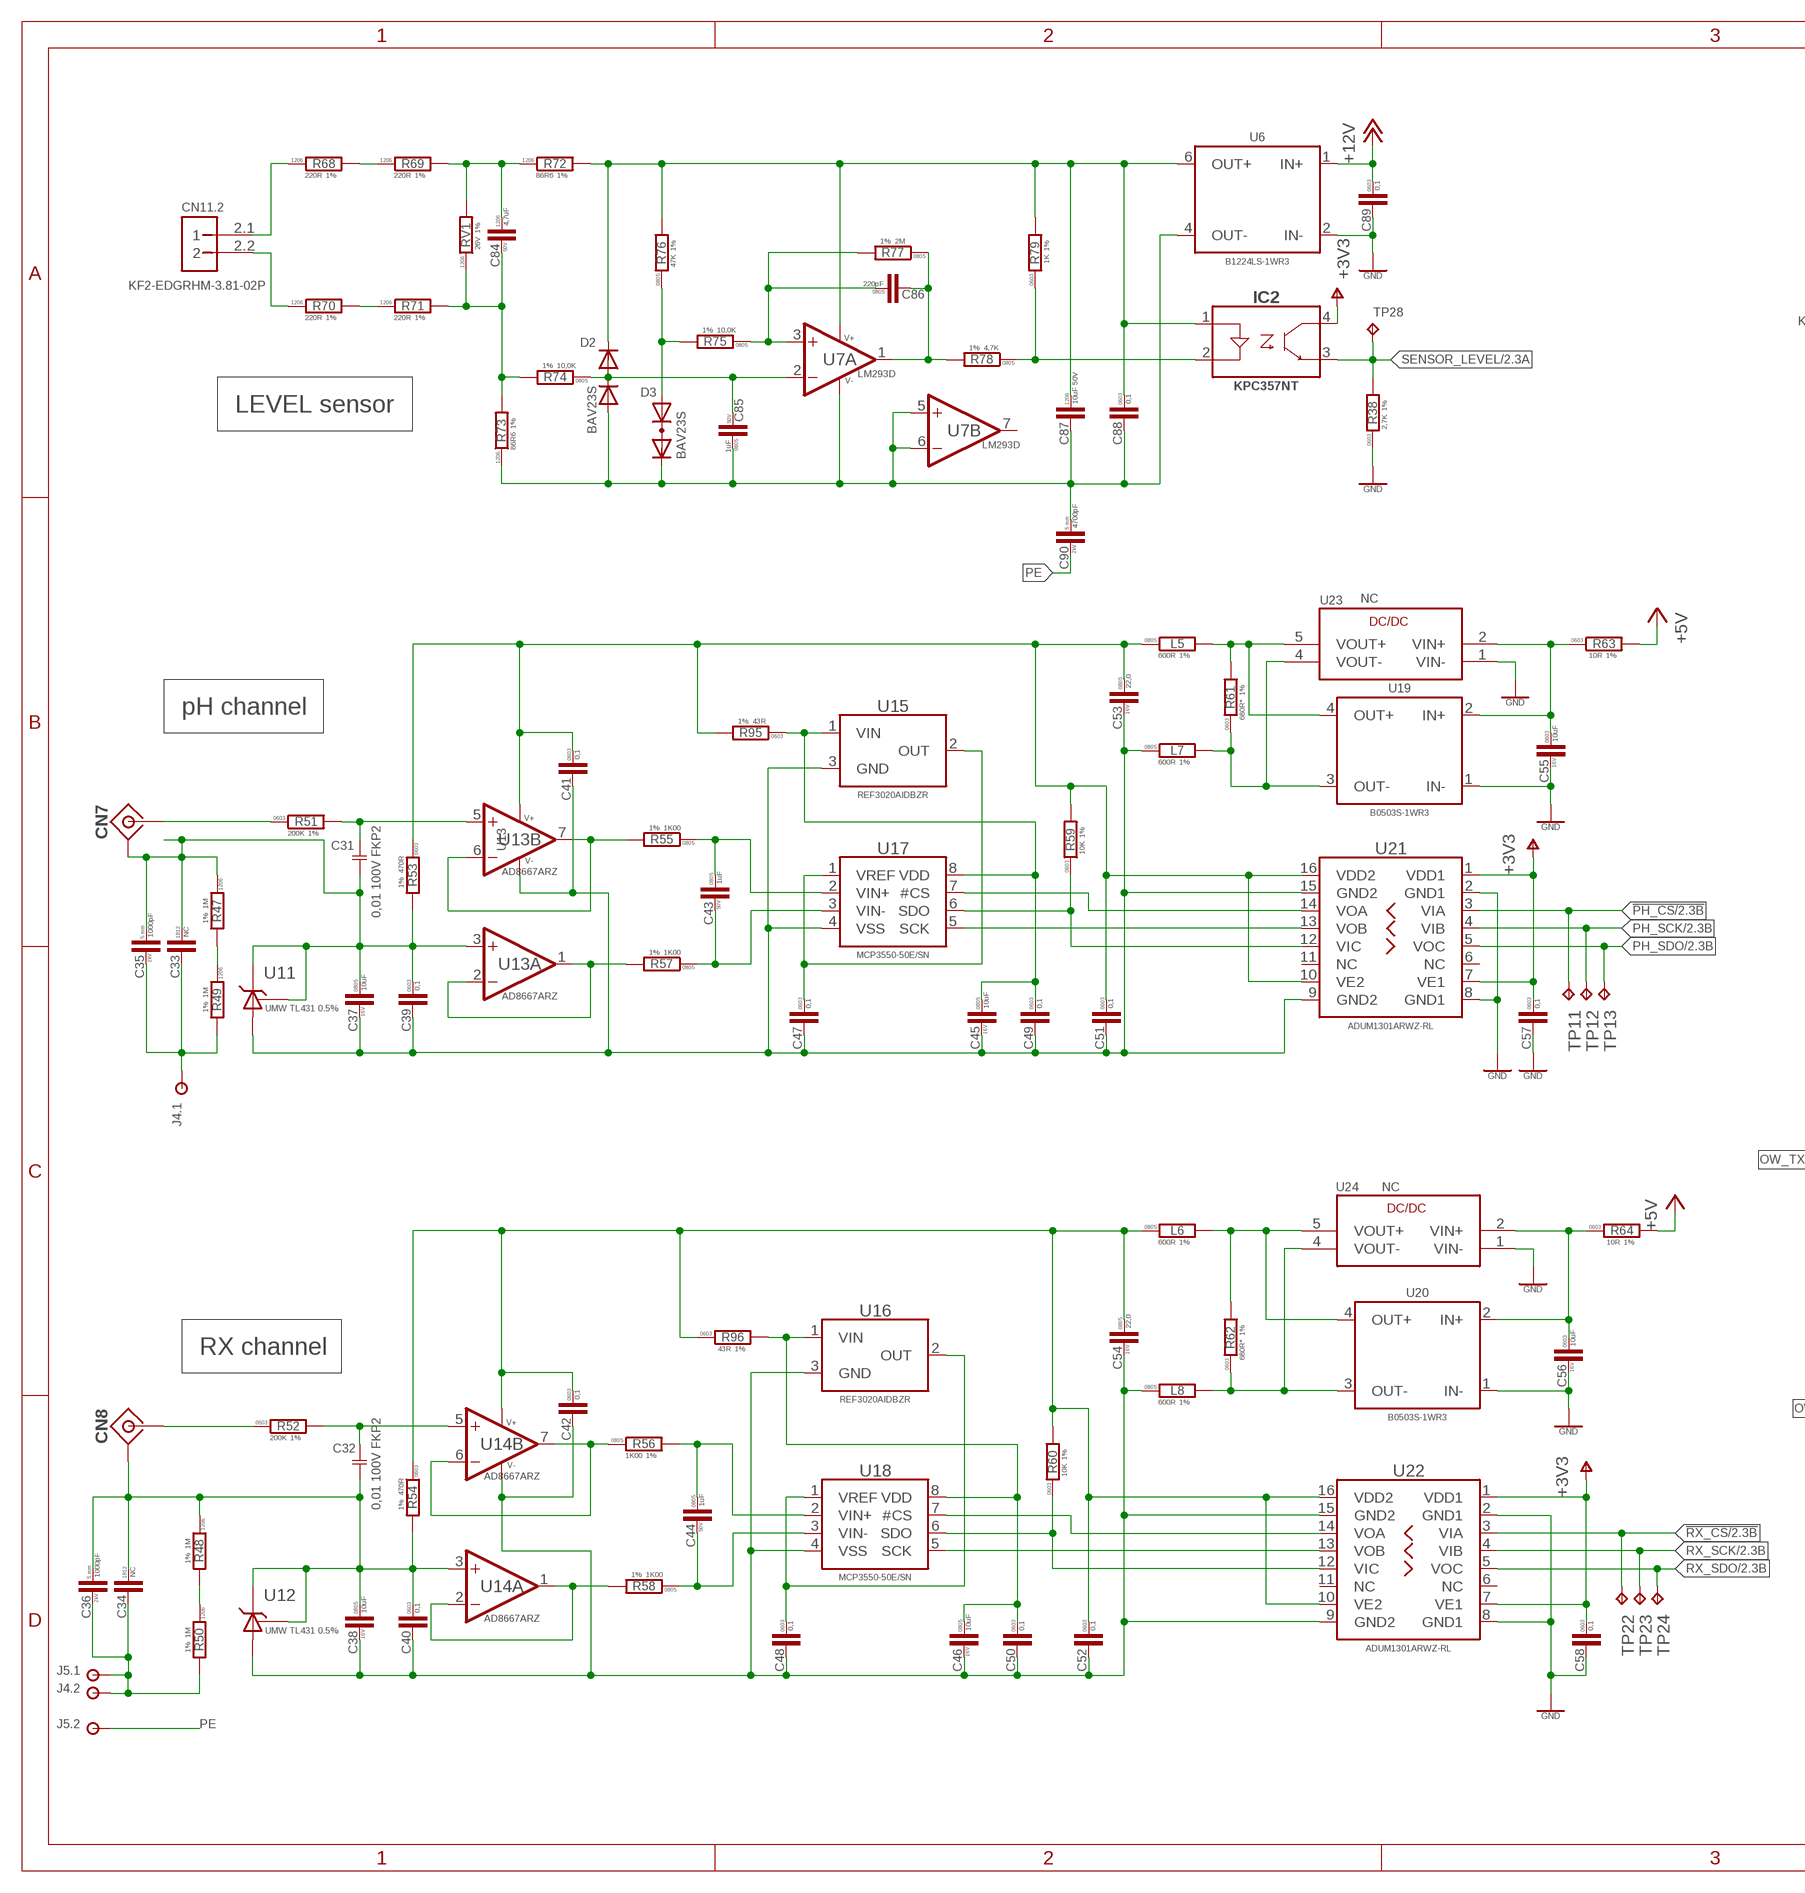
[diagram p4: schematic, sheet 3, part 1 of 2]
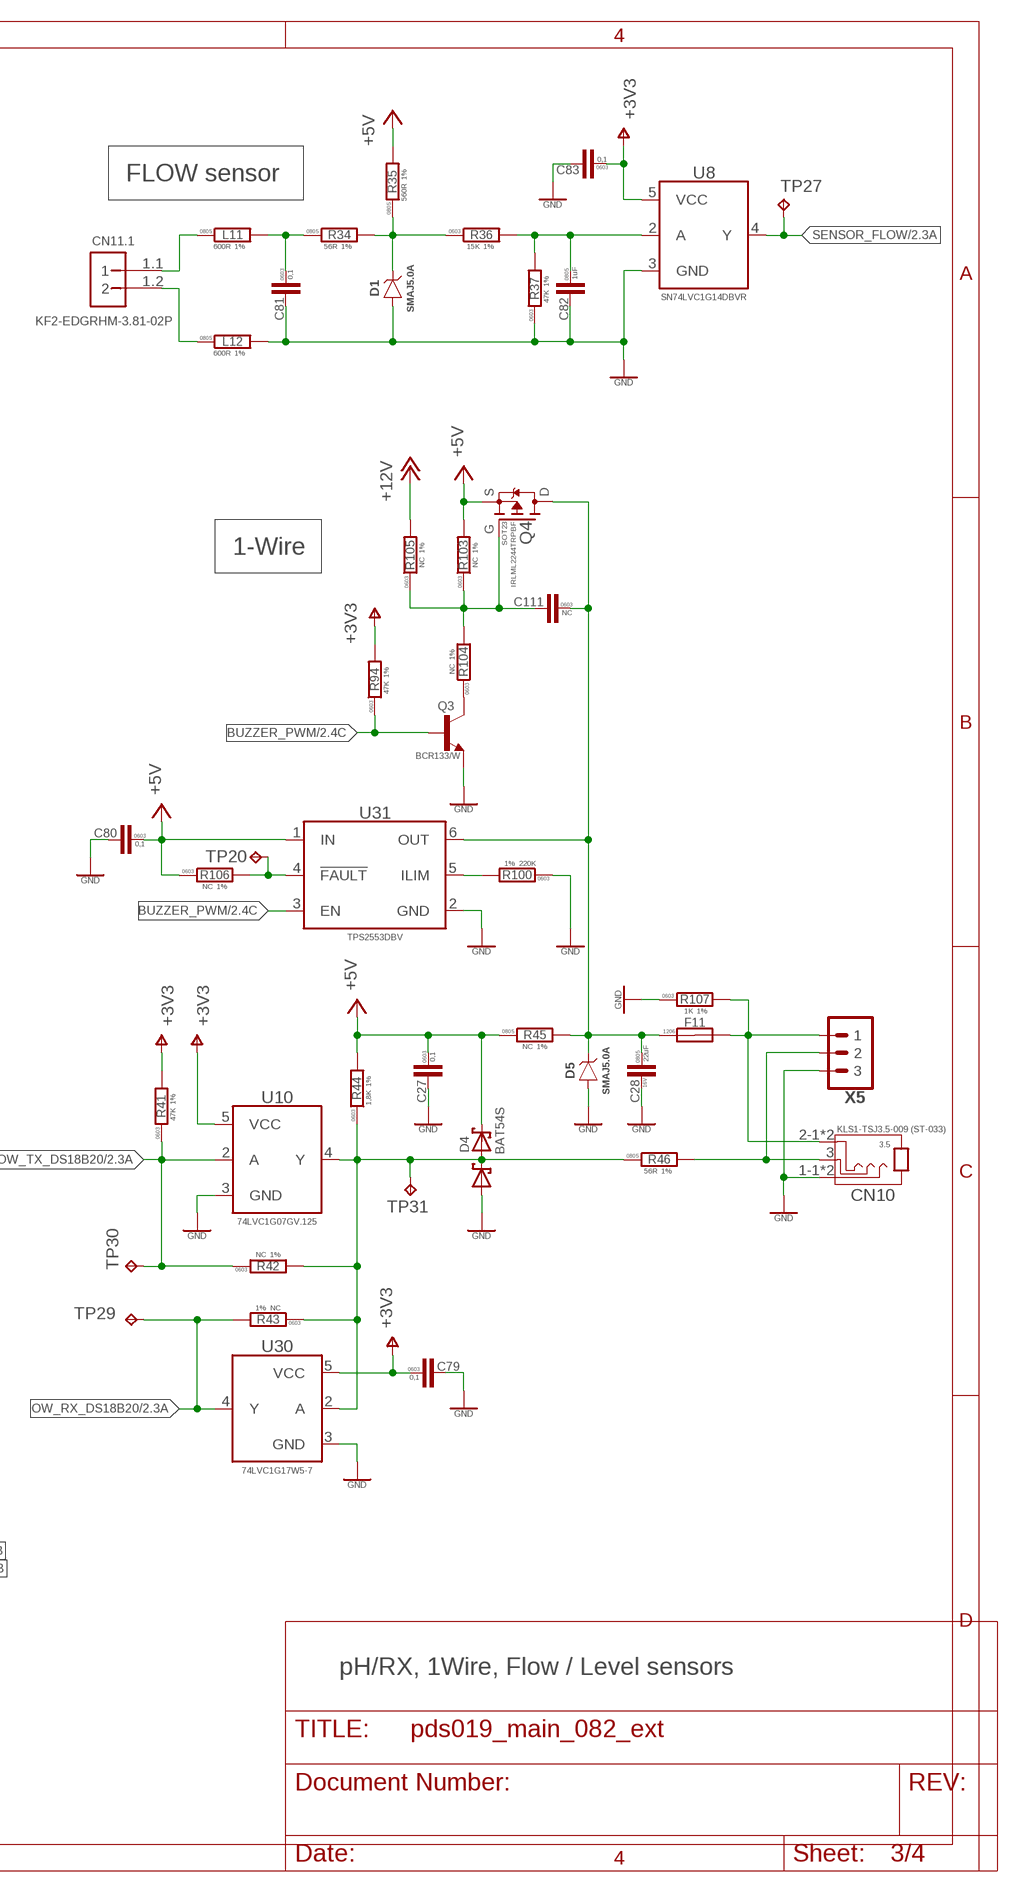
[diagram p5: schematic, sheet 3, part 2 of 2]

### Parts
C27  0,1  C-0603  [C0603]
C28  22uF  C-0805  [C0805]
C31  0,01 100V FKP2  FKP2_1G  [C050-055X072]
C32  0,01 100V FKP2  FKP2_1G  [C050-055X072]
C33  NC  C-1812  [C1812]
C34  NC  C-1812  [C1812]
C35  1000pF  C-RADIAL-5MM  [C_5MM]
C36  1000pF  C-RADIAL-5MM  [C_5MM]
C37  10uF  C-0805  [C0805]
C38  10uF  C-0805  [C0805]
C39  0,1  C-0603  [C0603]
C40  0,1  C-0603  [C0603]
C41  0,1  C-0603  [C0603]
C42  0,1  C-0603  [C0603]
C43  1uF  C-0805  [C0805]
C44  1uF  C-0805  [C0805]
C45  10uF  C-0805  [C0805]
C46  10uF  C-0805  [C0805]
C47  0,1  C-0603  [C0603]
C48  0,1  C-0603  [C0603]
C49  0,1  C-0603  [C0603]
C50  0,1  C-0603  [C0603]
C51  0,1  C-0603  [C0603]
C52  0,1  C-0603  [C0603]
C53  22,0  C-0805  [C0805]
C54  22,0  C-0805  [C0805]
C55  10uF  C-0603  [C0603]
C56  10uF  C-0603  [C0603]
C57  0,1  C-0603  [C0603]
C58  0,1  C-0603  [C0603]
C79  0,1  C-0603  [C0603]
C80  0,1  C-0603  [C0603]
C81  0,1  C-0603  [C0603]
C82  1uF  C-0805  [C0805]
C83  0,1  C-0603  [C0603]
C84  4,7uF  C-1206  [C1206]
C85  1uF  C-0805  [C0805]
C86  220pF  C-0805  [C0805]
C87  10uF 50V  C-1206  [C1206]
C88  0,1  C-0603  [C0603]
C89  0,1  C-0603  [C0603]
C90  4700pF  C-RADIAL-5MM  [C_5MM]
C111  NC  C-0603  [C0603]
CN7  RF_CONNECTOR-BNC-KY-WE  [BNC_JR_CHN]
CN8  RF_CONNECTOR-BNC-KY-WE  [BNC_JR_CHN]
CN10  ST-033  [ST-033]
CN11  KF2-EDGRHM-3.81-02P  TBLOCK_2X02P-KF2-EDGRHM-3.81-02P  [KF2EDGRHM-3.81-02P]
D1  SMAJ5.0A  [DO-214AC(SMA)]
D2  BAV23S  [SOT23-123]
D3  BAV23S  [SOT23-123]
D4  BAT54S  [SOT23]
D5  SMAJ5.0A  [DO-214AC(SMA)]
F11  NC  FUSE-1206  [F1206]
IC2  KPC357NT-SOP-4  [-SOP-4]
J4.1  CONN_PAD-1,5R  [CONN_PAD_1.5]
J4.2  CONN_PAD-1,5R  [CONN_PAD_1.5]
J5.1  CONN_PAD-1,5R  [CONN_PAD_1.5]
J5.2  CONN_PAD-1,5R  [CONN_PAD_1.5]
L5  600R  R-1%-0805  [R0805]
L6  600R  R-1%-0805  [R0805]
L7  600R  R-1%-0805  [R0805]
L8  600R  R-1%-0805  [R0805]
L11  600R  R-1%-0805  [R0805]
L12  600R  R-1%-0805  [R0805]
Q3  NC  BCR133  [SOT23B-3]
Q4  NC  IRLML2244  [SOT23]
R34  56R  R-1%-0805  [R0805]
R35  560R  R-1%-0805  [R0805]
R36  15K  R-1%-0603  [R0603]
R37  47K  R-1%-0603  [R0603]
R38  2,7K  R-1%-0603  [R0603]
R41  47K  R-1%-0603  [R0603]
R42  NC  R-1%-0603  [R0603]
R43  NC  R-1%-0603  [R0603]
R44  1,8K  R-1%-0603  [R0603]
R45  NC  R-1%-0805  [R0805]
R46  56R  R-1%-0805  [R0805]
R47  1M  R-1%-1206  [R1206]
R48  1M  R-1%-1206  [R1206]
R49  1M  R-1%-1206  [R1206]
R50  1M  R-1%-1206  [R1206]
R51  200K  R-1%-0603  [R0603]
R52  200K  R-1%-0603  [R0603]
R53  470R  R-1%-0603  [R0603]
R54  470R  R-1%-0603  [R0603]
R55  1K00  R-1%-0805  [R0805]
R56  1K00  R-1%-0805  [R0805]
R57  1K00  R-1%-0805  [R0805]
R58  1K00  R-1%-0805  [R0805]
R59  10K  R-1%-0603  [R0603]
R60  10K  R-1%-0603  [R0603]
R61  680R*  R-1%-0603  [R0603]
R62  680R*  R-1%-0603  [R0603]
R63  10R  R-1%-0603  [R0603]
R64  10R  R-1%-0603  [R0603]
R68  220R  R-1%-1206  [R1206]
R69  220R  R-1%-1206  [R1206]
R70  220R  R-1%-1206  [R1206]
R71  220R  R-1%-1206  [R1206]
R72  86R6  R-1%-1206  [R1206]
R73  86R6  R-1%-1206  [R1206]
R74  10,0K  R-1%-0805  [R0805]
R75  10,0K  R-1%-0805  [R0805]
R76  47K  R-1%-0805  [R0805]
R77  2M  R-1%-0805  [R0805]
R78  4,7K  R-1%-0805  [R0805]
R79  1K  R-1%-0603  [R0603]
R94  47K  R-1%-0603  [R0603]
R95  43R  R-1%-0603  [R0603]
R96  43R  R-1%-0603  [R0603]
R100  220K  R-1%-0603  [R0603]
R103  NC  R-1%-0603  [R0603]
R104  NC  R-1%-0603  [R0603]
R105  NC  R-1%-0603  [R0603]
R106  NC  R-1%-0603  [R0603]
R107  1K  R-1%-0603  [R0603]
RV1  26V  R-1%-1206  [R1206]
TP11  TPTP16R  [TP16R]
TP12  TPTP16R  [TP16R]
TP13  TPTP16R  [TP16R]
TP20  TPTP16R  [TP16R]
TP22  TPTP16R  [TP16R]
TP23  TPTP16R  [TP16R]
TP24  TPTP16R  [TP16R]
TP27  TPTP16R  [TP16R]
TP28  TPTP16R  [TP16R]
TP29  TPTP16R  [TP16R]
TP30  TPTP16R  [TP16R]
TP31  TPTP16R  [TP16R]
U6  B1224LS-1WR3  [SIP7_6X19.65_SINGLE]
U7  LM293D  LM293D-SO8  [SOIC8]
U8  74LVC1G14DBV  [SOT23-5]
U10  74LVC1G07GV  [SOT23-5]
U11  TL431  [SOT23B-3]
U12  TL431  [SOT23B-3]
U13  AD8667ARZ-SO8  [SOIC8]
U14  AD8667ARZ-SO8  [SOIC8]
U15  REF3020AIDBZ  [SOT23B-3]
U16  REF3020AIDBZ  [SOT23B-3]
U17  MCP3550  [SOIC8]
U18  MCP3550  [SOIC8]
U19  B0503S-1WR3  [SIP-4]
U20  B0503S-1WR3  [SIP-4]
U21  ISO7231CDW  ADUM1301  [SO-16W]
U22  ISO7231CDW  ADUM1301  [SO-16W]
U23  NC  PSDV-0505ELF-2  [PSDV_ELF_2]
U24  NC  PSDV-0505ELF-2  [PSDV_ELF_2]
U30  74LVC1G17  [SOT23-5]
U31  TPS2553DBV  [SOT23-6]
X5  PINHEAD_1X03-2.54  [1X03-PTH-2.54]

### Nets
!PH_CS: TP11.TP U21.3(VIA) ; also sheet 2
!RX_CS: TP22.TP U22.3(VIA) ; also sheet 2
+3V3: C57.1 C58.1 C79.1 C83.1 IC2.4(COLLECTOR) R41.2 R94.2 U8.5(VCC) U10.5(VCC) U21.1(VDD1) U21.7(VE1) U22.1(VDD1) U22.7(VE1) U30.5(VCC) ; also sheet 1,2
+5V: C27.1 C80.1 D4.2(C2) Q4.2(S) R35.2 R44.2 R45.1 R63.2 R64.2 R103.2 R106.1 U31.1(IN) ; also sheet 1,2
+12V: C89.1 R105.2 U6.1(IN+) ; also sheet 1
BUZZER_PWM: Q3.1(B) R94.1 U31.3(EN) ; also sheet 2
GND: C27.2 C28.2 C55.2 C56.2 C57.2 C58.2 C79.2 C80.2 C81.2 C82.2 C83.2 C89.2 CN10.1-1(S) CN10.1-2(S) D1.A D4.1(A1) D5.A L12.2 Q3.2(E) R37.1 R38.1 R100.1 R107.1 U6.2(IN-) U8.3(GND) U10.3(GND) U19.1(IN-) U20.1(IN-) U21.2(GND1) U21.8(GND1) U22.2(GND1) U22.8(GND1) U23.1(VIN-) U24.1(VIN-) U30.3(GND) U31.2(GND) X5.3 ; also sheet 1,2
LVL_24V [24V]: C87.P$1 C88.1 D2.2(C2) IC2.1(A) R72.P$2 R76.2 R79.2 U6.6(OUT+) U7.8(P:V+)
LVL_GND: C85.1 C87.P$2 C88.2 C90.1 D2.1(A1) D3.2(C2) R73.P$1 U6.4(OUT-) U7.4(P:V-) U7.5(B:IN+) U7.6(B:IN-)
LVL_SNS+ [24V]: CN11.2.1 R68.P$1
LVL_SNS- [24V]: CN11.2.2 R70.P$1
N$12: CN7.1(ANT) R51.1
N$13: CN8.1(ANT) R52.1
N$14: C32.1 R52.2 U14.5(B:IN+)
N$21: R106.2 TP20.TP U31.4(!FAULT)
N$23 [24V]: IC2.2(C) R78.1 R79.1
N$24: C46.1 C50.1 R96.2 U16.1(VIN) U18.8(VDD)
N$25: C45.1 C49.1 R95.1 U15.1(VIN) U17.8(VDD)
N$29: C28.1 C111.1 D5.C F11.P$1 Q4.3(D) R45.2 U31.6(OUT)
N$31 [24V]: C86.2 R77.1 R78.2 U7.1(A:OUT)
N$33: R48.P$2 R50.P$1
N$34: L5.2 R61.2 U19.4(OUT+) U23.5(VOUT+)
N$40 [24V]: C85.2 D2.3(C1A2) R74.1 U7.2(A:IN-)
N$41 [24V]: C81.1 L11.2 R34.1
N$42: L7.2 R61.1 U19.3(OUT-) U23.4(VOUT-)
N$53: L6.2 R62.2 U20.4(OUT+) U24.5(VOUT+)
N$55: L8.2 R62.1 U20.3(OUT-) U24.4(VOUT-)
N$57 [24V]: C84.P$1 R69.P$2 R72.P$1 RV1.P$2
N$61 [24V]: CN11.1.1 L11.1
N$62: R47.P$2 R49.P$1
N$65 [24V]: CN11.1.2 L12.1
N$66 [24V]: R68.P$2 R69.P$1
N$67: D1.C R34.2 R35.1 R36.1
N$68: C55.1 R63.1 U19.2(IN+) U23.2(VIN+)
N$70: C56.1 R64.1 U20.2(IN+) U24.2(VIN+)
N$71 [24V]: R70.P$2 R71.P$1
N$72: R100.2 U31.5(ILIM)
N$73 [24V]: C86.1 R75.1 R77.2 U7.3(A:IN+)
N$74 [24V]: D3.1(A1) R75.2 R76.1
N$75: Q3.3(C) R104.1
N$76 [24V]: C84.P$2 R71.P$2 R73.P$2 R74.2 RV1.P$1
N$77: C111.2 Q4.1(G) R103.1 R104.2 R105.1
N$79: D4.3(C1A2) R42.2 R43.1 R44.1 R46.1 TP31.TP U10.4(Y) U30.2(A)
N$89: C82.1 R36.2 R37.2 U8.2(A)
N$165: CN10.2-1(T) CN10.2-2(T) F11.P$2 R107.2 X5.1
N$178: CN10.3(R) R46.2 X5.2
OW_RX_DS18B20: R43.2 TP29.TP U30.4(Y) ; also sheet 2
OW_TX_DS18B20: R41.1 R42.1 TP30.TP U10.2(A) ; also sheet 2
PE: C90.2 J5.2.1 ; also sheet 1
PE_PH: C33.P$2 C35.2 J4.1.1 R49.P$2
PE_RX: C34.P$2 C36.2 J4.2.1 J5.1.1 R50.P$2
PH_ADCCS: U17.7(#CS) U21.14(VOA)
PH_ADCSCK: U17.5(SCK) U21.13(VOB)
PH_ADCSDO: R59.1 U17.6(SDO) U21.12(VIC)
PH_AMP_VO+: R55.2 U13.6(B:IN-) U13.7(B:OUT)
PH_AMP_VO-: R57.2 U13.1(A:OUT) U13.2(A:IN-)
PH_GND: C37.2 C39.2 C41.2 C45.2 C47.2 C49.2 C51.2 C53.2 L7.1 U11.3(A) U13.4(P:V-) U15.3(GND) U17.4(VSS) U21.9(GND2) U21.15(GND2)
PH_SCK: TP12.TP U21.4(VIB) ; also sheet 2
PH_SDO: TP13.TP U21.5(VOC) ; also sheet 2
PH_VCC: C41.1 C51.1 C53.1 L5.1 R53.1 R59.2 R95.2 U13.8(P:V+) U21.10(VE2) U21.16(VDD2)
PH_VCOM: C31.2 C33.P$1 C35.1 C37.1 C39.1 CN7.M1(GND) CN7.M2(GND) CN7.M3(GND) CN7.M4(GND) R47.P$1 R53.2 U11.1(R) U11.2(C) U13.3(A:IN+)
PH_VINF: C31.1 R51.2 U13.5(B:IN+)
PH_VREF: C47.1 U15.2(OUT) U17.1(VREF)
PHADC+: C43.1 R55.1 U17.2(VIN+)
PHADC-: C43.2 R57.1 U17.3(VIN-)
RX_ADCCS: U18.7(#CS) U22.14(VOA)
RX_ADCSCK: U18.5(SCK) U22.13(VOB)
RX_ADCSDO: R60.1 U18.6(SDO) U22.12(VIC)
RX_AMP_VO+: R56.1 U14.6(B:IN-) U14.7(B:OUT)
RX_AMP_VO-: R58.2 U14.1(A:OUT) U14.2(A:IN-)
RX_COM: C32.2 C34.P$1 C36.1 C38.1 C40.1 CN8.M1(GND) CN8.M2(GND) CN8.M3(GND) CN8.M4(GND) R48.P$1 R54.2 U12.1(R) U12.2(C) U14.3(A:IN+)
RX_GND: C38.2 C40.2 C42.2 C46.2 C48.2 C50.2 C52.2 C54.2 L8.1 U12.3(A) U14.4(P:V-) U16.3(GND) U18.4(VSS) U22.9(GND2) U22.15(GND2)
RX_SCK: TP23.TP U22.4(VIB) ; also sheet 2
RX_SDO: TP24.TP U22.5(VOC) ; also sheet 2
RX_VCC: C42.1 C52.1 C54.1 L6.1 R54.1 R60.2 R96.1 U14.8(P:V+) U22.10(VE2) U22.16(VDD2)
RX_VREF: C48.1 U16.2(OUT) U18.1(VREF)
RXADC+: C44.1 R56.2 U18.2(VIN+)
RXADC-: C44.2 R58.1 U18.3(VIN-)
SENSOR_FLOW: TP27.TP U8.4(Y) ; also sheet 2
SENSOR_LEVEL: IC2.3(EMITTER) R38.2 TP28.TP ; also sheet 2
Unconnected: D3.3(C1A2) U7.7(B:OUT) U21.6(NC) U21.11(NC) U22.6(NC) U22.11(NC)

### Notes on the sheet
- FLOW sensor
- LEVEL sensor
- 1-Wire
- pH channel
- RX channel
- pH/RX, 1Wire, Flow / Level sensors

## Sheet 4 of 4
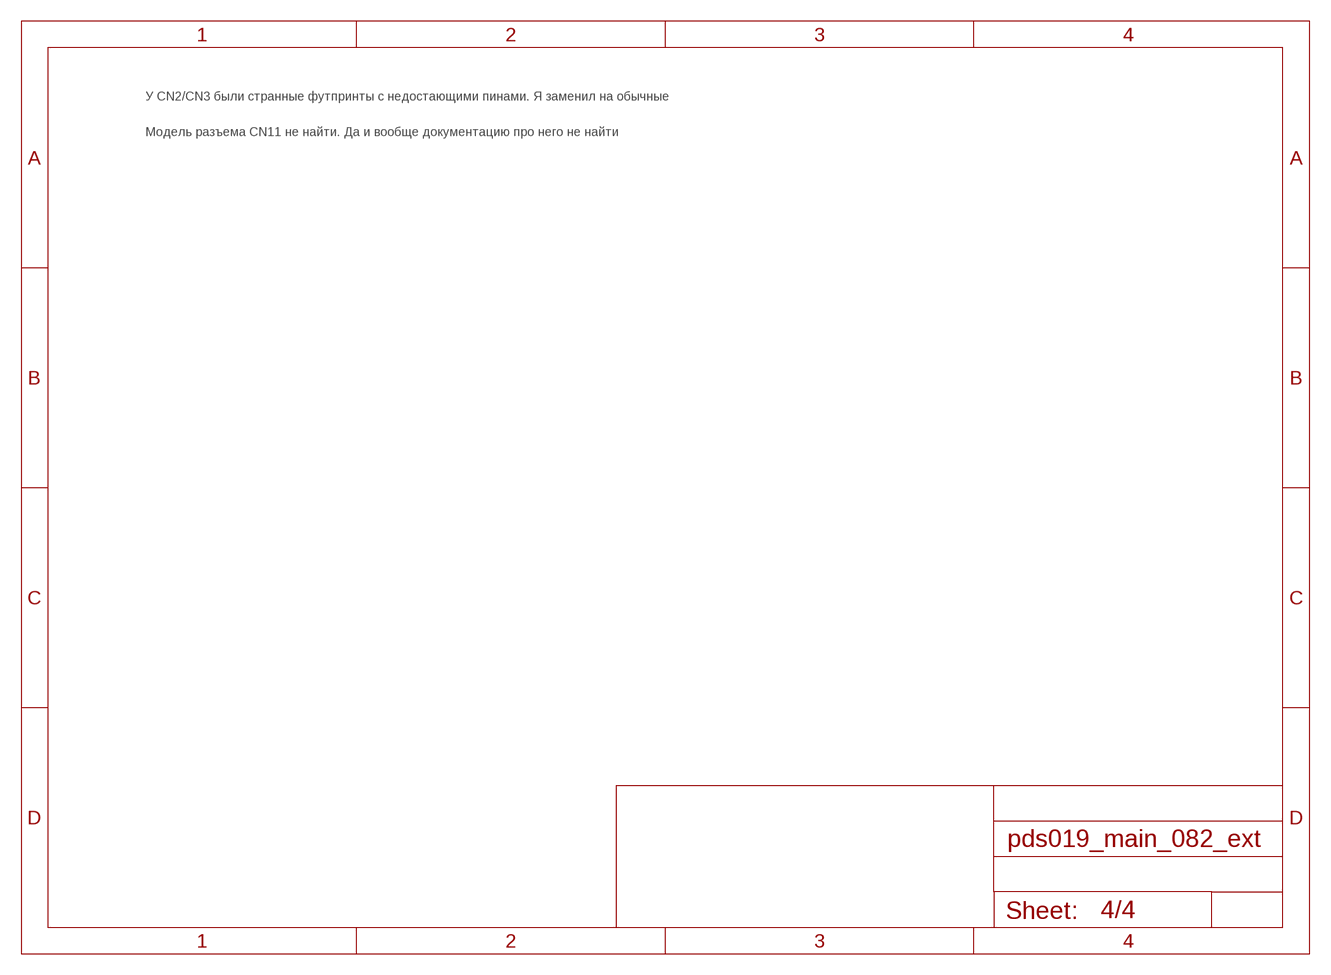
[diagram p6: schematic, sheet 4]

### Notes on the sheet
- У CN2/CN3 были странные футпринты с недостающими пинами. Я заменил на обычные
- Модель разъема CN11 не найти. Да и вообще документацию про него не найти

## Library data of the parts
BAT1 = mechanical:BATTERY; BATTERY_TYPE: CR2032; MANF: KLS; MANF#: L-KLS5-CR2032-01
BZ1 = pds018:BUZZER: Buzzer
C1-C4 C7-C11 C14-C25 C27 C29 C30 C39-C42 C47-C52 C57 C58 C61 C62 C65-C68 C74 C77-C81 C83 C88 C89 C91-C107 C109 C111 = rc:C; PACKAGE: 0603
C5 C6 C26 C28 C37 C38 C45 C46 C53 C54 C110 = rc:C; PACKAGE: 0805; VOLTAGE: 16V
C12 C13 C75 C76 C82 C86 = rc:C; PACKAGE: 0805
C31 C32 = pds019:FKP2: WIMA FKP2 series capacitor; MF: WIMA; PKG: 5,5X7,2; TOL: 5%; TYPE: PP; VOLT: 63V
C33 C34 = rc:C; PACKAGE: 1812
C35 C36 C90 C108 = rc:C; PACKAGE: 5 mm; VOLTAGE: 2kV
C43 C44 C85 = rc:C; PACKAGE: 0805; VOLTAGE: 50V
C55 C56 = rc:C; PACKAGE: 0603; VOLTAGE: 16V
C59 = rc:CPOL: Polar electrolytic or tantalum capacitor; PACKAGE: TYPE D; VOLTAGE: 25V
C60 = rc:CPOL: Polar electrolytic or tantalum capacitor; PACKAGE: TYPE B; VOLTAGE: 6.3V
C63 C64 C69-C71 C73 C87 = rc:C; PACKAGE: 1206
C72 = rc:CPOL: Polar electrolytic or tantalum capacitor; PACKAGE: TYPE D; VOLTAGE: 16V
C84 = rc:C; PACKAGE: 1206; VOLTAGE: 50V
CN1 = degson:CON-3P; MANF: DEGSON; MANF#: 2EDGRM-7.62-03P-1Y-100A&Z(H); TYPE: 2EDGRM
CN2 CON2 = Connectors:CON-5P; MANF: JST Corporation; MANF#: B5P-VH
CN4 = degson:CON-2X2; MANF: DEGSON; MANF#: 2EDGRHM-5.08-04P; TYPE: 2EDGRHM-5.08
CN7 CN8 = Connectors:RF_CONNECTOR
CN10 = Connectors:ST-033: Stereo audio jack 3.5 mm; MANF: KLS electronic co ltd; MANF#: KLS1-TSJ3.5-009 (ST-033)
CN11 = pds019:TBLOCK_2X02P
CN12 = Connectors:IDC_CONN10: 10PIN dual row male 2.54mm pitch IDC type connector Igor Odaikin, March 2020; MANF: Connfly electronic; MANF#: BH-10
CN13 = Connectors:IDC_CONN14: 14PIN dual row (2 x 07) male 2.54mm pitch IDC type connector Igor Odaikin, Jan 2023; MANF: Connfly electronic; MANF#: BH-14
CON1 = pinhead:PINHEAD_2X03
CON3 CON4 = degson:CON-2X3; MANF: DEGSON; MANF#: 2EDGRHM-5.08-06P; TYPE: 2EDGRHM-5.08
CON5 = Connectors:USB-A: USB-A (USB TYPE-A) Receptacle Connector 4 Position Through Hole, Right Angle; MANF: KLS electronic co ltd; MANF#: L-KLS1-191-4P-W
CON6 = pinhead:PINHEAD_1X20
D1 D5 = TVS_diodes:SMAJ5.0A; MANF: Littelfuse Inc; MANF#: SMAJ5.0A
D2 D3 = pds019:BAV23S
D4 = pds019:BAT54S: Schottky Diodes Pin connection corrected 2011-05-04 Source: Fairchild .. BAT54.pdf; MARK: L44; MF: Fairchild; PKG: SOT23-3
D6 = Diodes:SS34: 40V 3A 550mV @ 3A SMA(DO-214AC) Schottky Barrier Diodes; LCSC#: C8678; MANF: MDD（Microdiode Electronics）; MANF#: SS34
D8 = TVS_diodes:SMBJ15A: 15V Unidirectional SMB(DO-214AA) TVS ROHS; MANF: Littelfuse; MANF#: SMBJ15A
ENC1 = misc:ENC
F1-F9 = rc:FUSE; PACKAGE: FC-001S
F10 = rc:FUSE; CURRENT: 500 mA; PACKAGE: 1206
F11 = rc:FUSE; PACKAGE: 1206
HL1-HL16 = misc:NEOPIXEL; MANF: Shenzhen Shining Opto-Electronic Co; MANF#: SK6805-2427
IC1 = dc-dc:TPS54231: 2A, 28V INPUT, STEP DOWN DC/DC CONVERTER WITH ECO-MODE; MANF: Texas Instruments; MANF#: TPS54231
IC2 = misc:KPC357NT: 4PIN MINI-FLAT PHOTOTRANSISTOR PHOTOCOUPLER; MANF: COSMO; MANF#: KPC357NT
J4.1 J4.2 J5.1 J5.2 = pds019:CONN_PAD
K1-K5 K7 = misc:SRD
L1 = power_inductors:22µH: Wirewound Inductor; LCSC#: C108292; MANF: Chilisin; MANF#: MHCI06030-220M-R8
L2 = power_inductors:3.3µH; MANF: Chilisin; MANF#: MHCI05030-3R3M-R8LM
L3-L13 R34 R35 R45 R46 R55-R58 R67 R74-R78 = rc:R; PACKAGE: 0805; TOLERANCE: 1%
L14 R47-R50 R68-R73 RV1 = rc:R; PACKAGE: 1206; TOLERANCE: 1%
LED1 = rc:LED: Light emitting diode; COLOR: GREEN; PACKAGE: 0805
M1-M3 M5 M7 M8 M10-M14 M17-M21 = pds019_main_082_ext:MPAD
M4 M9 = pds018:MPAD
PSU1 = ac-dc:IRM-10-12: AC/DC преобразователь, 12В, 0.85А, 10Вт; MANF: MEAN WELL; MANF#: IRM-10-12
Q1-Q3 = misc:BCR133: NPN Silicon Digital Transistor; MANF: INFINEON TECHNOLOGIES AG.; MANF#: BCR133/W
Q4 = mosfet:IRLML2244: MOSFET P-CH 20V 4.3A SOT-23-3; MANF: Infineon Technologies; MANF#: IRLML2244TRPBF; PACKAGE: SOT23
R1-R33 R36-R44 R51-R54 R59-R66 R79-R107 R110-R113 = rc:R; PACKAGE: 0603; TOLERANCE: 1%
RN1 = pds019_main_082_ext:RN4X1_EXP: 4 x 1 resistor array
SB1 = mechanical:TACT_SWITCH: tact switch; MANF: KLS; MANF#: KLS7-TS6601-4,3-180
TP1-TP10 TP14-TP19 TP21 TP25 TP26 = pds019_main_082_ext:TP: Test pad
TP11-TP13 TP20 TP22-TP24 TP27-TP31 = pds019:TP: Test pad
U1 = stm32:STM32F205RBT6: ARM® Cortex®-M3 STM32F2 Microcontroller IC 32-Bit 120MHz 128KB (128K x 8) FLASH 64-LQFP (10x10); DIGIKEY#: 497-11153-ND; MANF: STMicroelectronics; MANF#: STM32F205RBT6
U2 = ali_modules:ESP32-WROVER-(I)E: ESP32-WROVER-(I)E module Datasheet <https://documentation.espressif.com/esp32-wrover-e_esp32-wrover-ie_datasheet_en.pdf>; MANF: Espressif Systems; MANF#: ESP32-WROVER-E-N4R8
U3 = misc:ULN2003A: DRIVER ARRAY; DIGIKEY#: 296-1368-1-ND; MANF: Texas Instruments; MANF#: ULN2003ADR; OPERATING_TEMP: -20°C ~ 70°C
U5 = dc-dc:TPS563200: TPS56x200 4.5-V To 17-V Input, 2-A, 3-A Synchronous Step-Down Voltage Regulator In6 Pin SOT-23 datasheet <https://static.chipdip.ru/lib/786/DOC059786447.pdf>; MANF: Texas Instruments; MANF#: TPS563201DDC
U6 = dc-dc:B1224LS-1WR3; MANF: mornsun; MANF#: B1224LS-1WR3
U7 = misc:LM293D: Low-power, dual-voltage comparators; MANF: STMicroelectronics; MANF#: LM293D
U8 = misc:74LVC1G14DBV: SINGLE SCHMITT-TRIGGER INVERTER; MANF: Texas Instruments; MANF#: SN74LVC1G14DBVR
U9 = misc:MAX809S: Microprocessor voltage detection reset chip; MANF: STMicroelectronics; MANF#: STM809SWX6F
U10 = misc:74LVC1G07GV: Buffer with open-drain output; MANF: NXP Semiconductor; MANF#: 74LVC1G07GV.125
U11 U12 = misc:TL431: Adjustable Precision Shunt Regulator; MANF: Youtai Semiconductor (UMW); MANF#: UMW TL431 0.5%
U13 U14 = misc:AD8667ARZ: Low Noise, Precision, 16 V, CMOS, Rail-to-Rail Operational Amplifiers; MANF: Analog Devices; MANF#: AD8667ARZ
U15 U16 = misc:REF3020AIDBZ: REF30xx 50-ppm/°C Max, 50-μA, CMOS Voltage Reference in SOT-23-3; MANF: Texas Instruments; MANF#: REF3020AIDBZR
U17 U18 = misc:MCP3550: Low-Power, Single-Channel 22-Bit Delta-Sigma ADC; MANF: Microchip Technology; MANF#: MCP3550-50E/SN
U19 U20 = dc-dc:B0503S-1WR3: B0503S-1WR3, DC/DC преобразователь, 1Вт, вход 4.5-5.5В, выход 3.3В/303мА; MANF: Mornsun Power; MANF#: B0503S-1WR3
U21 U22 = serial_interfaces:ADUM1301; DIGIKEY#: ADUM1301ARWZ-RLCT-ND; MANF: Analog Devices Inc; MANF#: ADUM1301ARWZ-RL
U23 U24 = pds019:PSDV-0505ELF
U25 = misc:SN74LVC1T45DBV: Single-Bit Dual-Supply Bus Transceiver With Configurable Voltage Translation and 3-State Outputs; MANF: Texas Instruments; MANF#: SN74LVC1T45DBV
U26 = misc:SN74AHCT1G125DBVR: 74AHCT 1 Buffers，Non-OppositeSide 1 SOT-23-5 Buffers / Drivers ROHS; LCSC#: C7484; MANF: Texas Instruments; MANF#: SN74AHCT1G125DBVR
U27 = linear regulators:LM1117-3.3: Linear Voltage Regulator IC 1 Output 800mA SOT-223-4; DIGIKEY#: LM1117IMPX-3.3/NOPBCT-ND; LCSC#: C156196; MANF: Texas Instruments; MANF#: LM1117IMPX-3.3/NOPB
U28 U29 = pds019_main_082_ext:K78*-1000R
U30 = misc:74LVC1G17: single 1-input Schmitt-trigger buffer with a standard push-pull output; MANF: DIODES INC; MANF#: 74LVC1G17W5-7
U31 = misc:TPS2553DBV: Precision Adjustable Current-Limited Power-Distribution Switches; MANF: Texas Instruments; MANF#: TPS2553DBV
VR1 = rc:VARISTOR; MANF: KLS; MANF#: L-KLS6-20D431K
X1 = pinhead:PINHEAD_1X04
X2 X9 X10 = pinhead:PINHEAD_1X02: pinheader 2P
X3 = pinhead:PINHEAD_1X05: pinheader 5P
X5 X7 X8 = pinhead:PINHEAD_1X03: pinheader 3P
X11 = pds019_main_082_ext:CONN_3PIN: Generic 3-pin male connector
Z1 = crystal:CRYSTAL-4P: Smd Crystal; DIGIKEY#: 1253-1198-1-ND; MANF: Kyocera International Inc. Electronic Components; MANF#: CX3225GB24000P0HPQCC; VALUE: 24MHz
Z2 = crystal:CRYSTAL-2P

## Net classes
1 24V: clearance 0.305 mm
12 Vbat: width 0.229 mm, clearance 0.305 mm